# EAGLE schematic AM6548 (EAGLE 9.4.2), part 2 of 4
## Sheet 3 of 19: Regulators and DC-DC converters
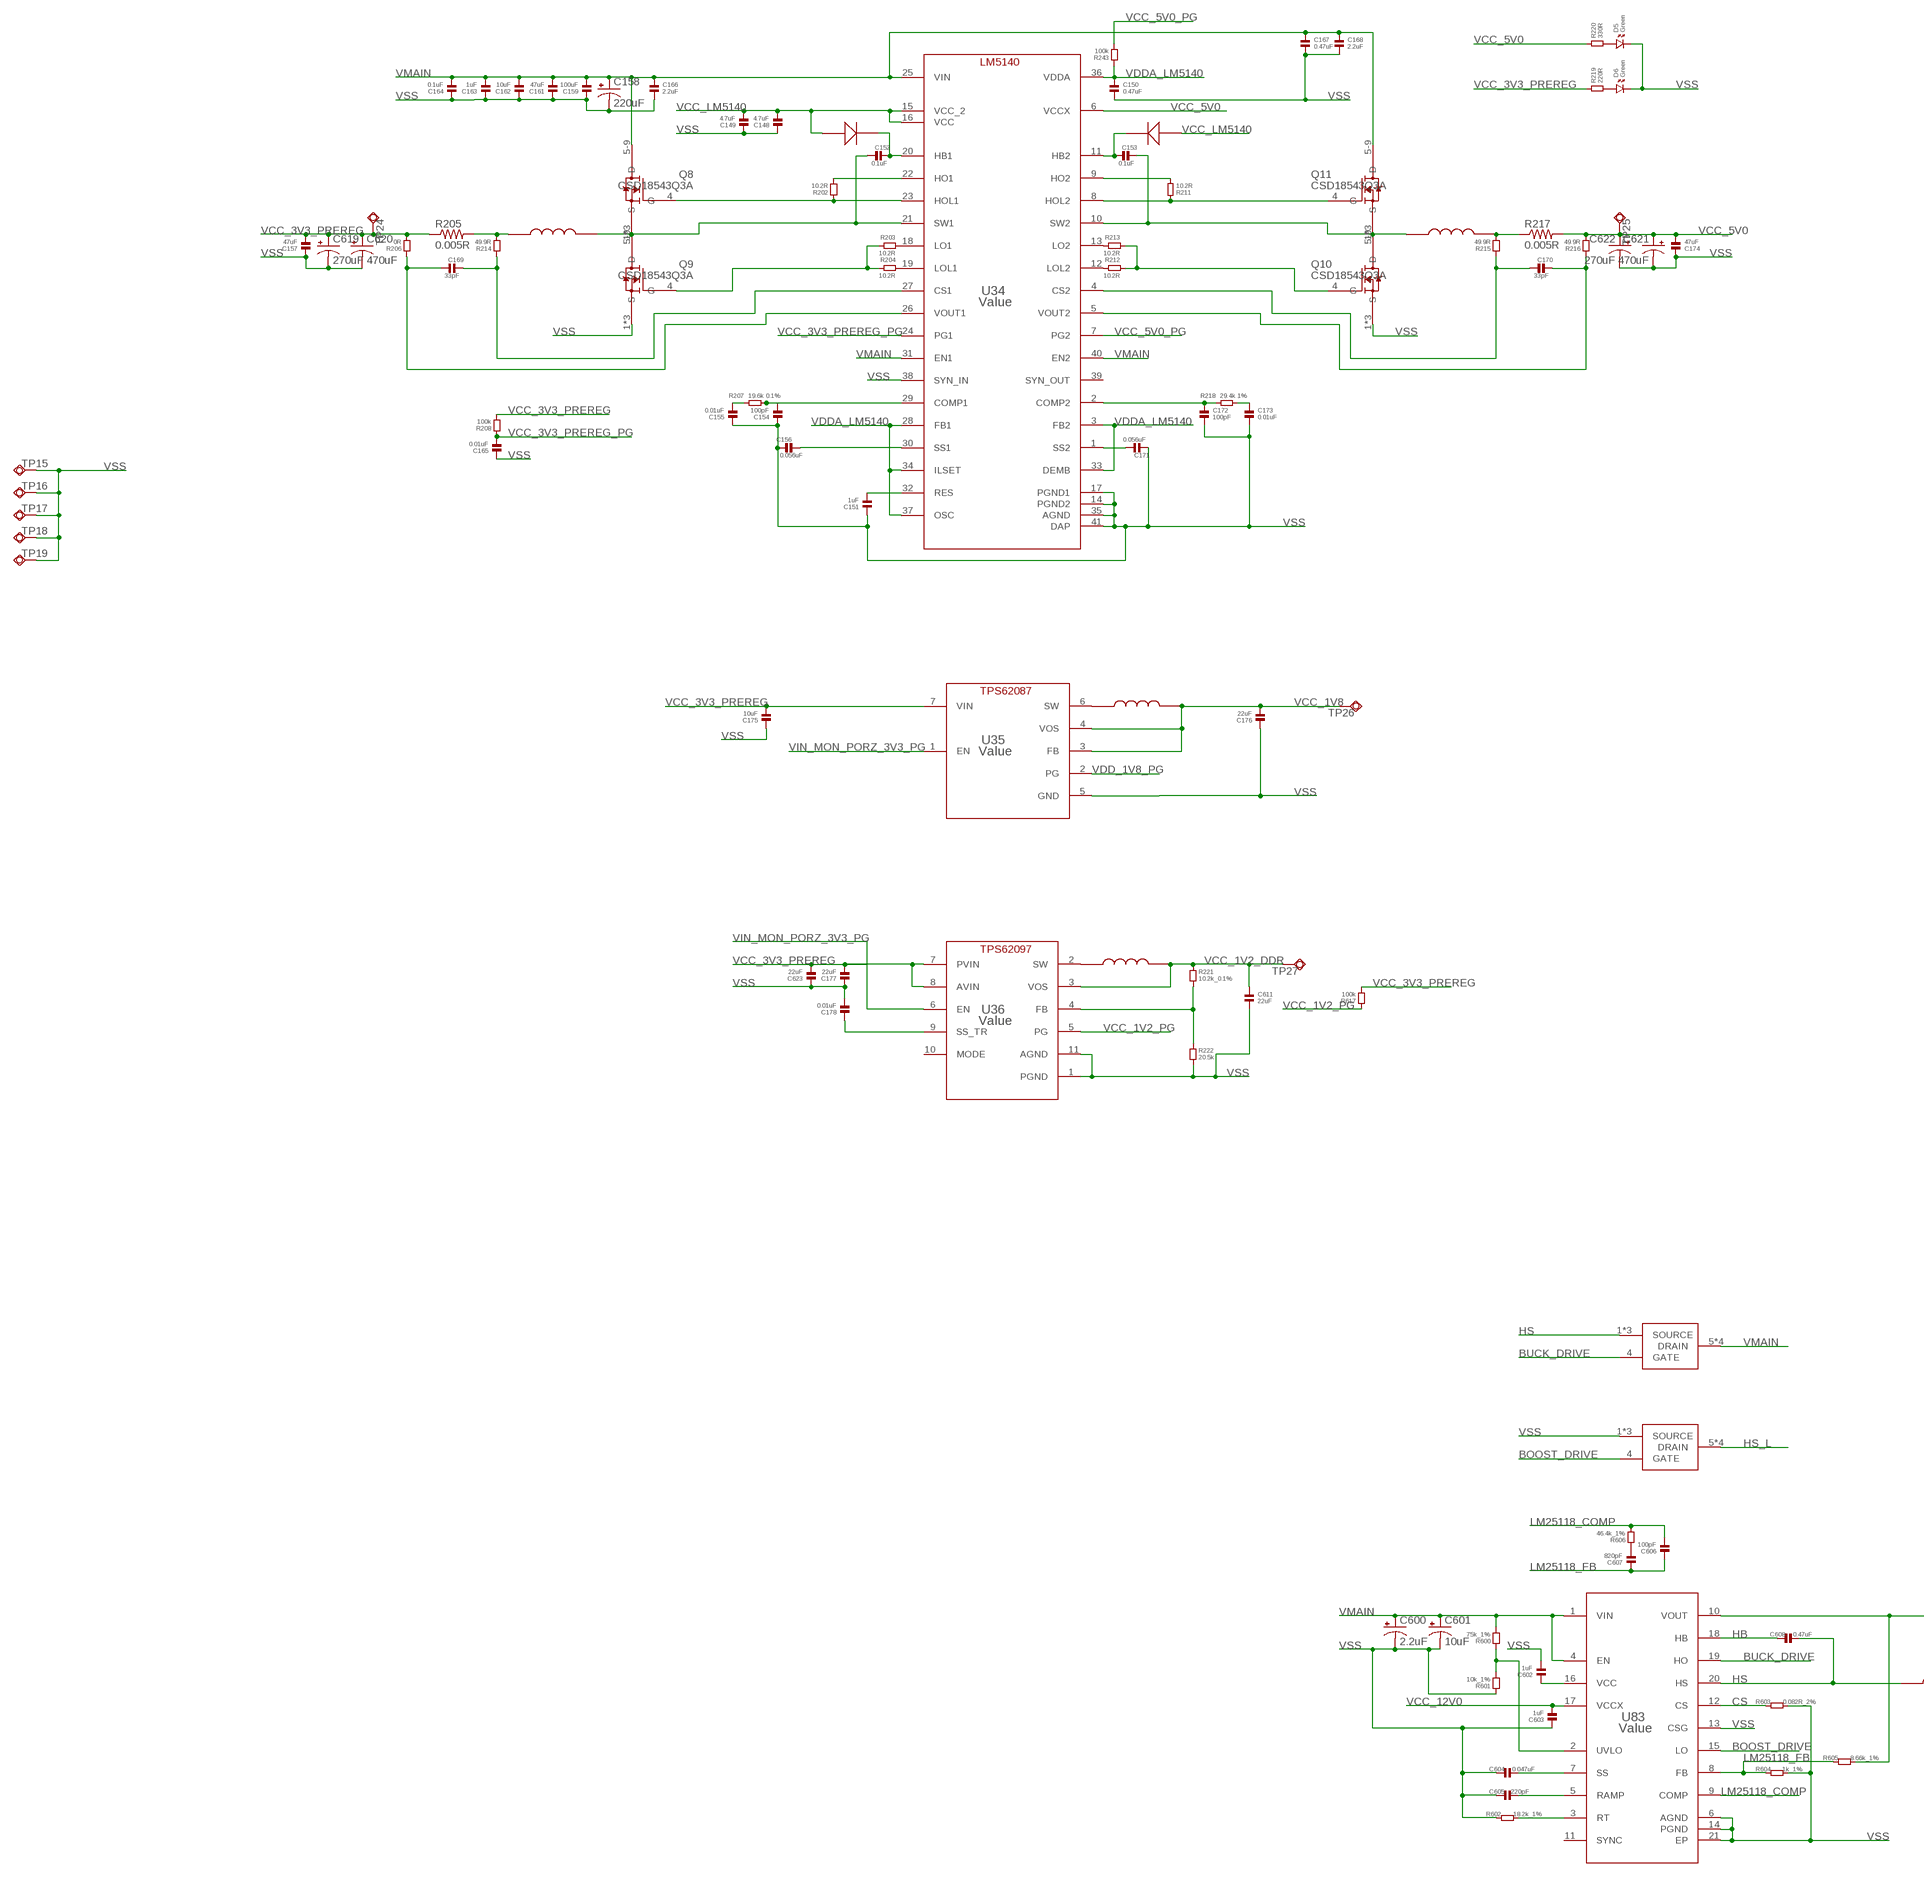
[diagram p4: schematic, sheet 3, part 1 of 3]
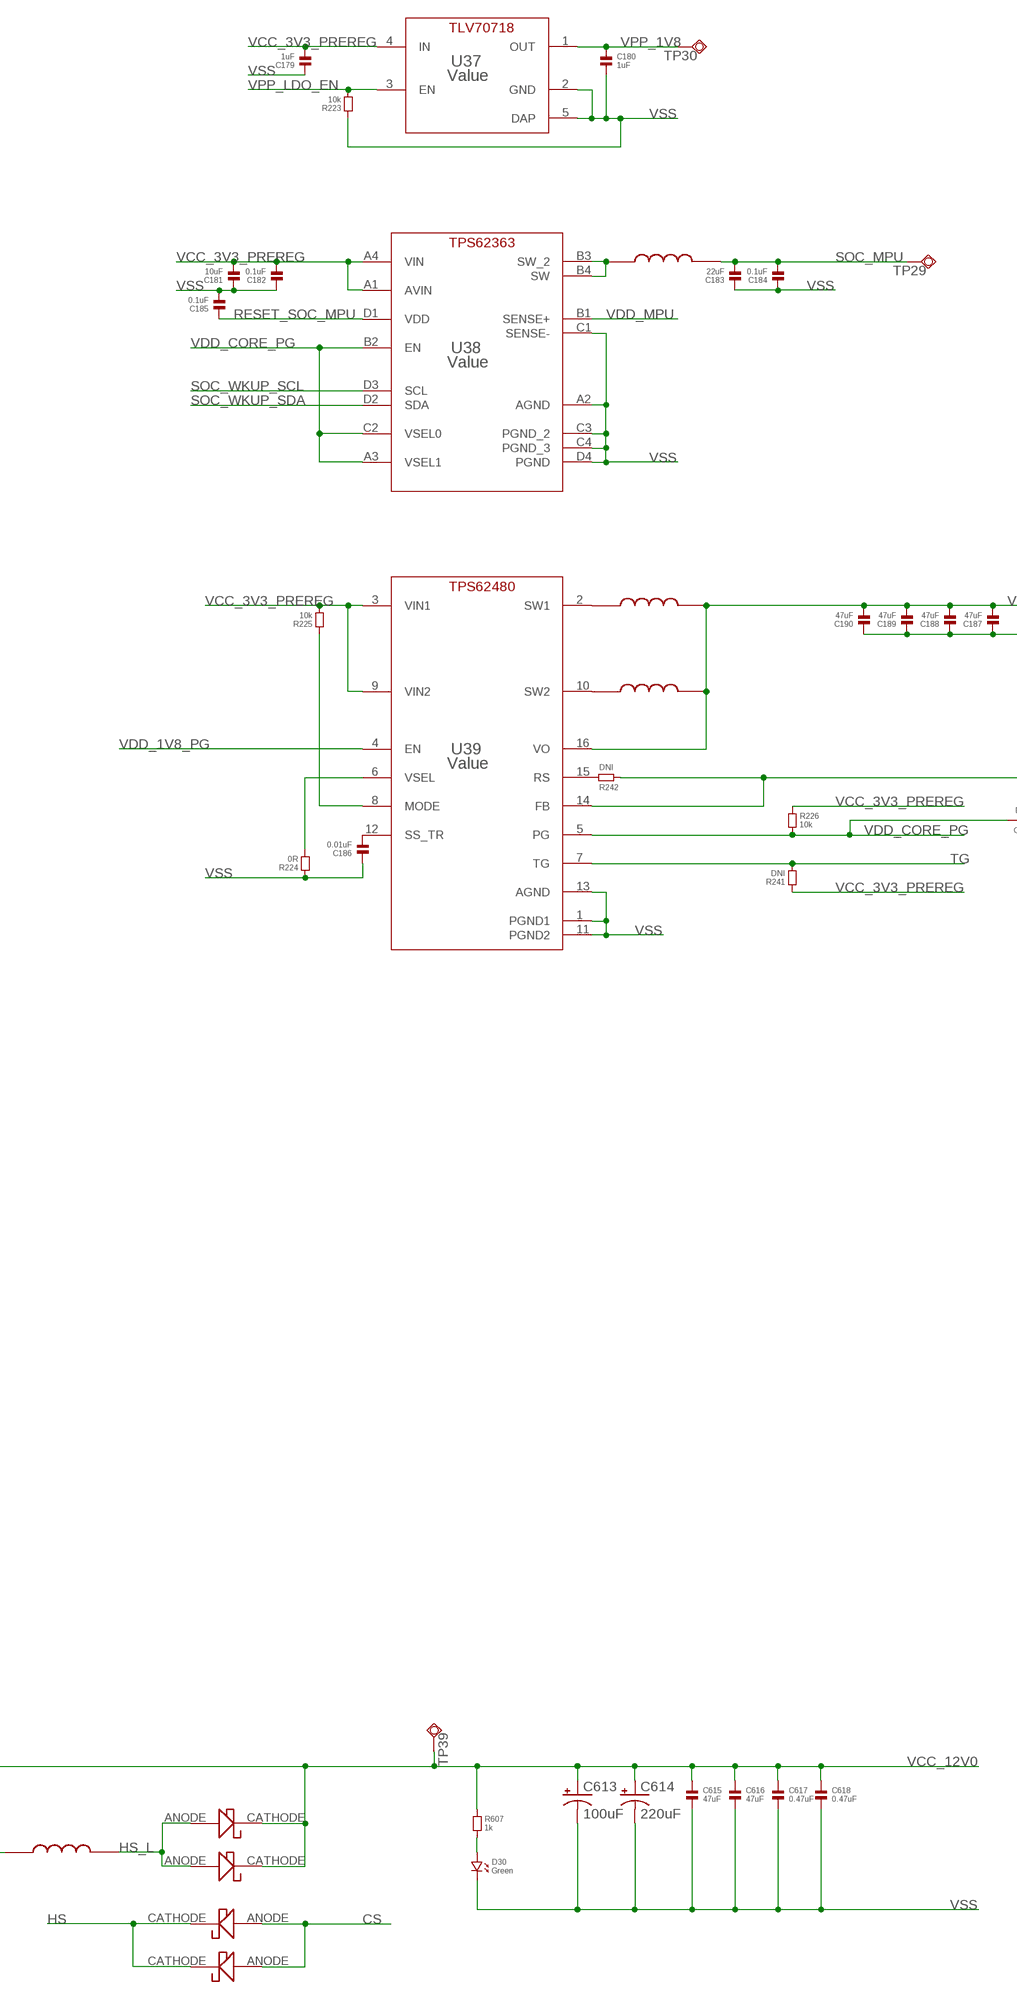
[diagram p5: schematic, sheet 3, part 2 of 3]
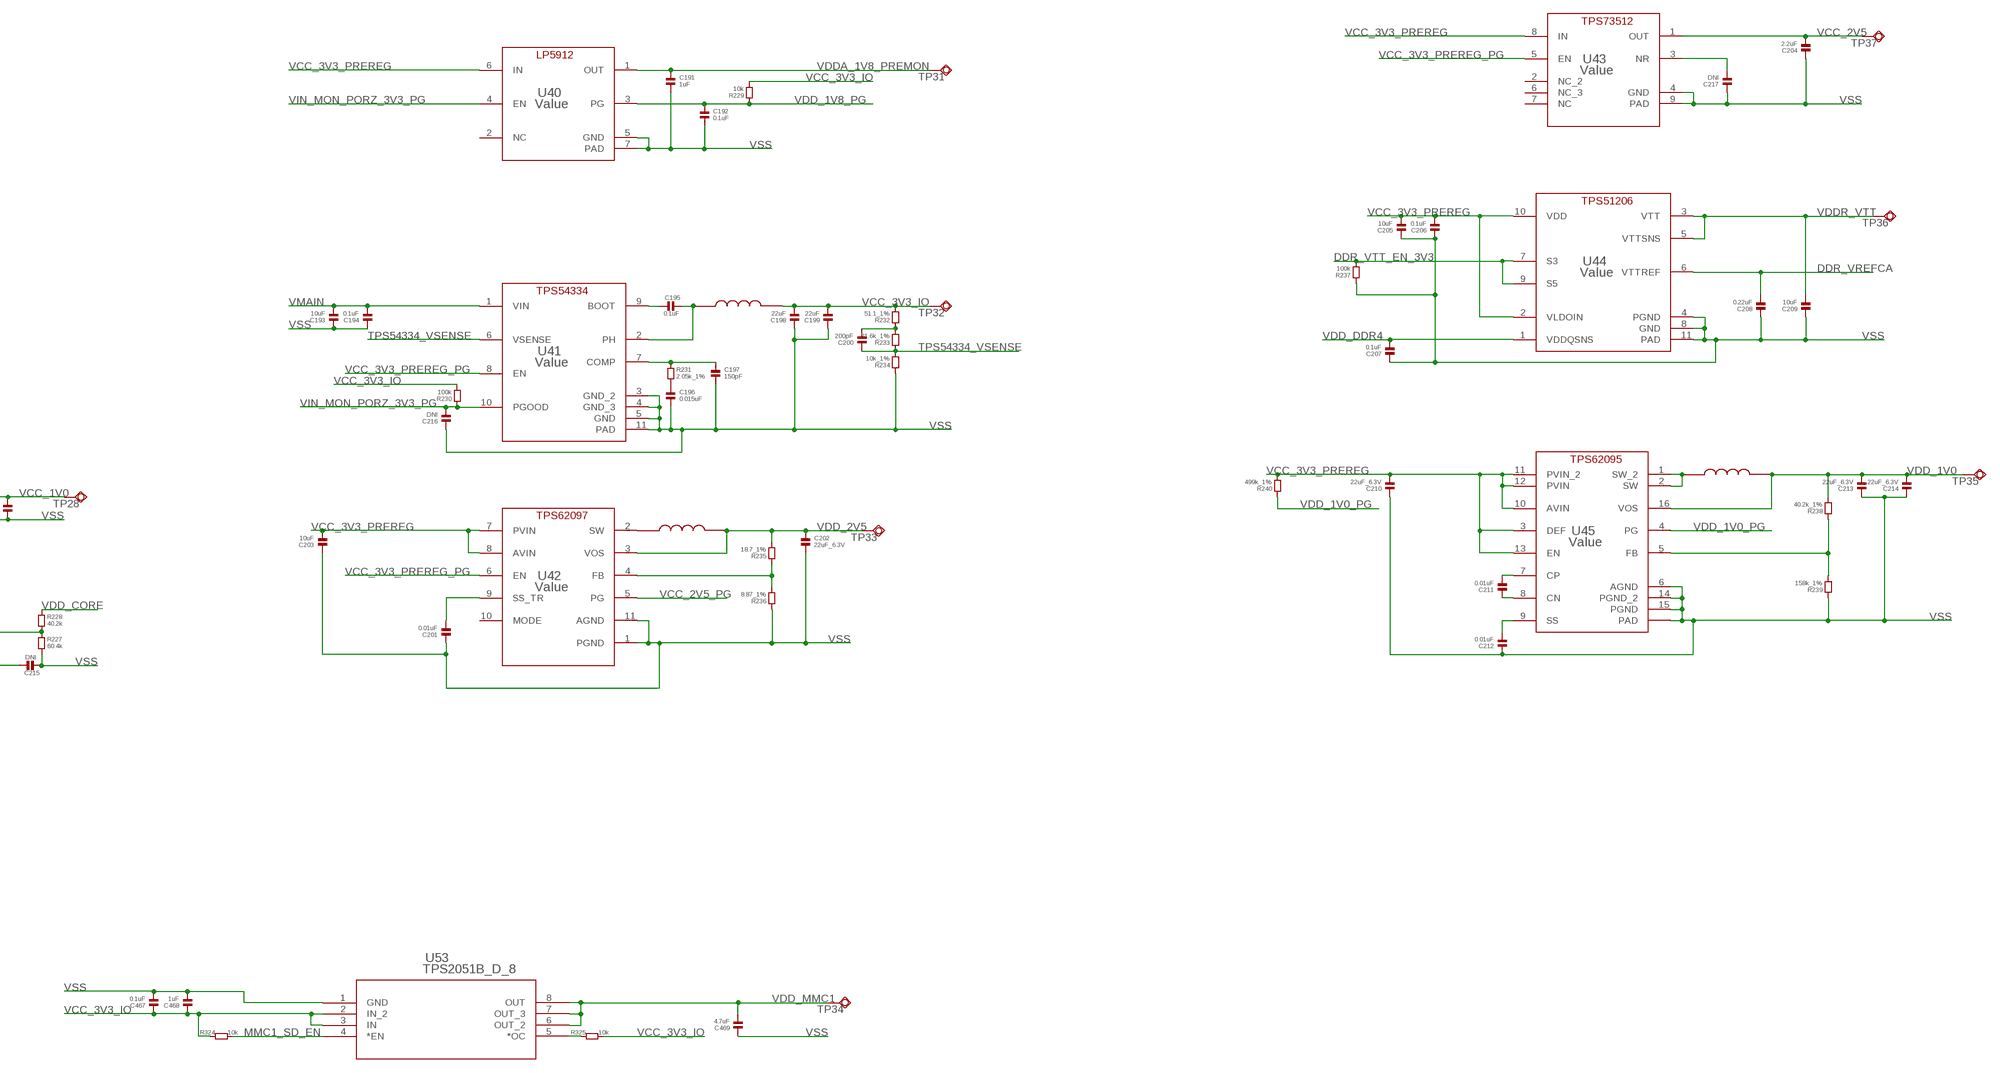
[diagram p6: schematic, sheet 3, part 3 of 3]

### Parts
C148  4.7uF  CAPACITOR.0603  [0603]
C149  4.7uF  CAPACITOR.0603  [0603]
C150  0.47uF  CAPACITOR.0805  [0805]
C151  1uF  CAPACITOR.0603  [0603]
C152  0.1uF  CAPACITOR.0603  [0603]
C153  0.1uF  CAPACITOR.0603  [0603]
C154  100pF  CAPACITOR.0603  [0603]
C155  0.01uF  CAPACITOR.0603  [0603]
C156  0.056uF  CAPACITOR.0603  [0603]
C157  47uF  CAPACITOR.0805  [0805]
C158  220uF  CPOL-USE3.5-8  [E3,5-8]
C159  100uF  CAPACITOR.0805  [0805]
C161  47uF  CAPACITOR.0805  [0805]
C162  10uF  CAPACITOR.0805  [0805]
C163  1uF  CAPACITOR.0805  [0805]
C164  0.1uF  CAPACITOR.0805  [0805]
C165  0.01uF  CAPACITOR.0603  [0603]
C166  2.2uF  CAPACITOR.0603  [0603]
C167  0.47uF  CAPACITOR.0603  [0603]
C168  2.2uF  CAPACITOR.0603  [0603]
C169  33pF  CAPACITOR.0603  [0603]
C170  33pF  CAPACITOR.0603  [0603]
C171  0.056uF  CAPACITOR.0603  [0603]
C172  100pF  CAPACITOR.0603  [0603]
C173  0.01uF  CAPACITOR.0603  [0603]
C174  47uF  CAPACITOR.0805  [0805]
C175  10uF  CAPACITOR.0603  [0603]
C176  22uF  CAPACITOR.0603  [0603]
C177  22uF  CAPACITOR.0603  [0603]
C178  0.01uF  CAPACITOR.0603  [0603]
C179  1uF  CAPACITOR.0603  [0603]
C180  1uF  CAPACITOR.0603  [0603]
C181  10uF  CAPACITOR.0603  [0603]
C182  0.1uF  CAPACITOR.0603  [0603]
C183  22uF  CAPACITOR.0603  [0603]
C184  0.1uF  CAPACITOR.0603  [0603]
C185  0.1uF  CAPACITOR.0603  [0603]
C186  0.01uF  CAPACITOR.0603  [0603]
C187  47uF  CAPACITOR.0805  [0805]
C188  47uF  CAPACITOR.0805  [0805]
C189  47uF  CAPACITOR.0805  [0805]
C190  47uF  CAPACITOR.0805  [0805]
C191  1uF  CAPACITOR.0603  [0603]
C192  0.1uF  CAPACITOR.0603  [0603]
C193  10uF  CAPACITOR.0805  [0805]
C194  0.1uF  CAPACITOR.0805  [0805]
C195  0.1uF  CAPACITOR.0603  [0603]
C196  0.015uF  CAPACITOR.0603  [0603]
C197  150pF  CAPACITOR.0603  [0603]
C198  22uF  CAPACITOR.0603  [0603]
C199  22uF  CAPACITOR.0603  [0603]
C200  200pF  CAPACITOR.0603  [0603]
C201  0.01uF  CAPACITOR.0603  [0603]
C202  22uF_6.3V  CAPACITOR.0603  [0603]
C203  10uF  CAPACITOR.0603  [0603]
C204  2.2uF  CAPACITOR.0603  [0603]
C205  10uF  CAPACITOR.0603  [0603]
C206  0.1uF  CAPACITOR.0603  [0603]
C207  0.1uF  CAPACITOR.0603  [0603]
C208  0.22uF  CAPACITOR.0603  [0603]
C209  10uF  CAPACITOR.0603  [0603]
C210  22uF_6.3V  CAPACITOR.0603  [0603]
C211  0.01uF  CAPACITOR.0603  [0603]
C212  0.01uF  CAPACITOR.0603  [0603]
C213  22uF_6.3V  CAPACITOR.0603  [0603]
C214  22uF_6.3V  CAPACITOR.0603  [0603]
C215  DNI  CAPACITOR.0603  [0603]
C216  DNI  CAPACITOR.0603  [0603]
C217  DNI  CAPACITOR.0603  [0603]
C467  0.1uF  CAPACITOR.0603  [0603]
C468  1uF  CAPACITOR.0603  [0603]
C469  4.7uF  CAPACITOR.0603  [0603]
C600  2.2uF  CPOL-USE2-4  [E2-4]
C601  10uF  CPOL-USE2-5  [E2-5]
C602  1uF  CAPACITOR.0603  [0603]
C603  1uF  CAPACITOR.0603  [0603]
C604  0.047uF  CAPACITOR.0603  [0603]
C605  220pF  CAPACITOR.0603  [0603]
C606  100pF  CAPACITOR.0603  [0603]
C607  820pF  CAPACITOR.0603  [0603]
C608  0.47uF  CAPACITOR.0603  [0603]
C611  22uF  CAPACITOR.0603  [0603]
C613  100uF  CPOL-USE2-5  [E2-5]
C614  220uF  CPOL-USE2-5  [E2-5]
C615  47uF  CAPACITOR.0805  [0805]
C616  47uF  CAPACITOR.0805  [0805]
C617  0.47uF  CAPACITOR.0603  [0603]
C618  0.47uF  CAPACITOR.0603  [0603]
C619  270uF  CPOL-USE3.5-8  [E3,5-8]
C620  470uF  CPOL-USE3.5-8  [E3,5-8]
C621  470uF  CPOL-USE3.5-8  [E3,5-8]
C622  270uF  CPOL-USE3.5-8  [E3,5-8]
C623  22uF  CAPACITOR.0603  [0603]
D5  Green  LED.0603  [0603.LED]
D6  Green  LED.0603  [0603.LED]
D30  Green  LED.0805  [0805.LED]
Q8  CSD18543Q3A  [SON65P300X315X90-9N]
Q9  CSD18543Q3A  [SON65P300X315X90-9N]
Q10  CSD18543Q3A  [SON65P300X315X90-9N]
Q11  CSD18543Q3A  [SON65P300X315X90-9N]
R202  10.2R  RESISTOR.0603  [0603]
R203  10.2R  RESISTOR.0603  [0603]
R204  10.2R  RESISTOR.0603  [0603]
R205  0.005R  R-US_R2512  [R2512]
R206  0R  RESISTOR.0603  [0603]
R207  19.6k 0.1%  RESISTOR.0603  [0603]
R208  100k  RESISTOR.0603  [0603]
R211  10.2R  RESISTOR.0603  [0603]
R212  10.2R  RESISTOR.0603  [0603]
R213  10.2R  RESISTOR.0603  [0603]
R214  49.9R  RESISTOR.0603  [0603]
R215  49.9R  RESISTOR.0603  [0603]
R216  49.9R  RESISTOR.0603  [0603]
R217  0.005R  R-US_R2512  [R2512]
R218  29.4k 1%  RESISTOR.0603  [0603]
R219  220R  RESISTOR.0603  [0603]
R220  330R  RESISTOR.0603  [0603]
R221  10.2k_0.1%  RESISTOR.0603  [0603]
R222  20.5k  RESISTOR.0603  [0603]
R223  10k  RESISTOR.0603  [0603]
R224  0R  RESISTOR.0603  [0603]
R225  10k  RESISTOR.0603  [0603]
R226  10k  RESISTOR.0603  [0603]
R227  60.4k  RESISTOR.0603  [0603]
R228  40.2k  RESISTOR.0603  [0603]
R229  10k  RESISTOR.0603  [0603]
R230  100k  RESISTOR.0603  [0603]
R231  2.05k_1%  RESISTOR.0603  [0603]
R232  51.1_1%  RESISTOR.0603  [0603]
R233  31.6k_1%  RESISTOR.0603  [0603]
R234  10k_1%  RESISTOR.0603  [0603]
R235  18.7_1%  RESISTOR.0603  [0603]
R236  8.87_1%  RESISTOR.0603  [0603]
R237  100k  RESISTOR.0603  [0603]
R238  40.2k_1%  RESISTOR.0603  [0603]
R239  158k_1%  RESISTOR.0603  [0603]
R240  499k_1%  RESISTOR.0603  [0603]
R241  DNI  RESISTOR.0603  [0603]
R242  DNI  RESISTOR.0603  [0603]
R243  100k  RESISTOR.0603  [0603]
R324  10k  RESISTOR.0603  [0603]
R325  10k  RESISTOR.0603  [0603]
R600  75k_1%  RESISTOR.0603  [0603]
R601  10k_1%  RESISTOR.0603  [0603]
R602  18.2k_1%  RESISTOR.0603  [0603]
R603  0.082R_2%  RESISTOR.0603  [0603]
R604  1k_1%  RESISTOR.0603  [0603]
R605  8.66k_1%  RESISTOR.0603  [0603]
R606  46.4k_1%  RESISTOR.0603  [0603]
R607  1k  RESISTOR.0603  [0603]
R617  100k  RESISTOR.0603  [0603]
TP15  TESTPAD_TPSQB1,27  [TESTPAD_B1,27]
TP16  TESTPAD_TPSQB1,27  [TESTPAD_B1,27]
TP17  TESTPAD_TPSQB1,27  [TESTPAD_B1,27]
TP18  TESTPAD_TPSQB1,27  [TESTPAD_B1,27]
TP19  TESTPAD_TPSQB1,27  [TESTPAD_B1,27]
TP24  TESTPAD_TPSQB1,27  [TESTPAD_B1,27]
TP25  TESTPAD_TPSQB1,27  [TESTPAD_B1,27]
TP26  TESTPAD_TPSQB1,27  [TESTPAD_B1,27]
TP27  TESTPAD_TPSQB1,27  [TESTPAD_B1,27]
TP28  TESTPAD_TPSQB1,27  [TESTPAD_B1,27]
TP29  TESTPAD_TPSQB1,27  [TESTPAD_B1,27]
TP30  TESTPAD_TPSQB1,27  [TESTPAD_B1,27]
TP31  TESTPAD_TPSQB1,27  [TESTPAD_B1,27]
TP32  TESTPAD_TPSQB1,27  [TESTPAD_B1,27]
TP33  TESTPAD_TPSQB1,27  [TESTPAD_B1,27]
TP34  TESTPAD_TPSQB1,27  [TESTPAD_B1,27]
TP35  TESTPAD_TPSQB1,27  [TESTPAD_B1,27]
TP36  TESTPAD_TPSQB1,27  [TESTPAD_B1,27]
TP37  TESTPAD_TPSQB1,27  [TESTPAD_B1,27]
TP39  TESTPAD_TPSQB1,27  [TESTPAD_B1,27]
U34  Value  LM5140QRWGRQ1  [RWG0040A]
U35  Value  TPS62087RLTR  [RLT0007A]
U36  Value  TPS62097RWKR  [RWK0011B]
U37  Value  TLV70718DQNR  [DQN0004A]
U38  Value  TPS62363YZHR  [YZH0016AFAF]
U39  Value  TPS62480RNCR  [RNC0016A]
U40  Value  LP5912-1.1DRVR  [DRV0006A]
U41  Value  TPS54334DRCR  [DRC0010J]
U42  Value  TPS62097RWKR  [RWK0011B]
U43  Value  TPS73512DRBR  [DRB0008A]
U44  Value  TPS51206DSQR  [DSQ0010A]
U45  Value  TPS62095RGTR  [RGT0016C]
U53  TPS2051B_D_8  [D8]
U83  Value  LM25118Q1MHX/NOPB  [PWP0020A_N]
U$20  DB2441700L  [DB2441700L]
U$21  DB2441700L  [DB2441700L]
U$22  XEL6030-152MEB  [XEL6030-152MEB]
U$25  XEL6030-152MEB  [XEL6030-152MEB]
U$28  XFL4015-471MEB  [XFL4015-471MEB]
U$29  XFL4020-102MEB  [XFL4020-102MEB]
U$30  XFL4015-471MEB  [XFL4015-471MEB]
U$31  XFL4015-471MEB  [XFL4015-471MEB]
U$32  XFL4015-471MEB  [XFL4015-471MEB]
U$33  XEL4030-682ME_  [XEL4030-682ME_]
U$34  XFL4020-102MEB  [XFL4020-102MEB]
U$35  XFL4020-102MEB  [XFL4020-102MEB]
U$39  XAL40XX  [XAL40XX]
U$40  SSB44-E3/52T  [SMB]
U$41  SSB44-E3/52T  [SMB]
U$42  SI4442DYSO-8  [SOIC127P600X175-8]
U$43  SI4442DYSO-8  [SOIC127P600X175-8]
U$44  SSB44-E3/52T  [SMB]
U$45  SSB44-E3/52T  [SMB]

### Nets
BOOST_DRIVE: U83.15(LO) U$43.4(GATE)
BUCK_DRIVE: U83.19(HO) U$42.4(GATE)
CS: R603.1 U83.12(CS) U$44.ANODE U$45.ANODE
DDR_VREFCA: C208.2 U44.6(VTTREF) ; also sheet 12
DDR_VTT_EN_3V3: R237.2 U44.7(S3) U44.9(S5) ; also sheet 15
HB: C608.1 U83.18(HB)
HS: C608.2 U83.20(HS) U$39.P$1 U$42.1(SOURCE) U$42.2(SOURCE) U$42.3(SOURCE) U$44.CATHODE U$45.CATHODE
HS_L: U$39.P$2 U$40.ANODE U$41.ANODE U$43.5(DRAIN) U$43.6(DRAIN) U$43.7(DRAIN) U$43.8(DRAIN)
LM25118_COMP: C606.2 R606.2 U83.9(COMP)
LM25118_FB: C606.1 C607.1 R604.1 R605.1 U83.8(FB)
MMC1_SD_EN: R324.2 U53.4(*EN)
N$159: C151.2 U34.32(RES)
N$162: C152.1 U34.20(HB1) U$21.CATHODE
N$163: C153.2 U34.11(HB2) U$20.CATHODE
N$164: C152.2 Q8.1(S) Q8.2(S) Q8.3(S) Q9.5-9(D) U34.21(SW1) U$22.P$2
N$165: Q8.4(G) R202.1 U34.23(HOL1)
N$166: R202.2 U34.22(HO1)
N$168: Q9.4(G) R203.1 R204.1
N$169: R203.2 U34.18(LO1)
N$170: R204.2 U34.19(LOL1)
N$171: R205.2 R214.2 U$22.P$1
N$172: C169.1 R214.1 U34.27(CS1)
N$173: C169.2 R206.1 U34.26(VOUT1)
N$174: C154.2 R207.2 U34.29(COMP1)
N$175: C155.2 R207.1
N$176: C156.2 U34.30(SS1)
N$177: C153.1 Q10.5-9(D) Q11.1(S) Q11.2(S) Q11.3(S) U34.10(SW2) U$25.P$1
N$178: Q11.4(G) R211.1 U34.8(HOL2)
N$179: R211.2 U34.9(HO2)
N$180: R212.1 U34.12(LOL2)
N$181: R213.1 U34.13(LO2)
N$182: Q10.4(G) R212.2 R213.2
N$183: R215.2 R217.1 U$25.P$2
N$184: C170.2 R215.1 U34.4(CS2)
N$185: C170.1 R216.1 U34.5(VOUT2)
N$186: C171.2 U34.1(SS2)
N$187: C173.1 R218.2
N$188: C172.1 R218.1 U34.2(COMP2)
N$189: D6.P$1 R219.2
N$190: D5.P$1 R220.2
N$191: U35.6(SW) U$28.P$1
N$192: C178.1 U36.9(SS_TR)
N$193: U36.2(SW) U$29.V
N$195: R221.2 R222.1 U36.4(FB)
N$196: U38.B3(SW_2) U38.B4(SW) U$30.P$1
N$197: C186.2 U39.12(SS_TR)
N$198: R224.2 U39.6(VSEL)
N$199: R225.1 U39.8(MODE)
N$200: U39.2(SW1) U$31.P$1
N$201: U39.10(SW2) U$32.P$1
N$202: R227.1 R228.2 R242.1 U39.14(FB)
N$203: C195.2 U41.2(PH) U$33.P$1
N$204: C195.1 U41.9(BOOT)
N$205: C196.1 R231.2
N$206: C197.1 R231.1 U41.7(COMP)
N$207: C200.2 R232.1 R233.2
N$208: C201.2 U42.9(SS_TR)
N$209: U42.2(SW) U$34.V
N$210: R235.1 R236.2 U42.4(FB)
N$212: C211.2 U45.7(CP)
N$213: C211.1 U45.8(CN)
N$214: C212.2 U45.9(SS)
N$215: U45.1(SW_2) U45.2(SW) U$35.V
N$216: R238.1 R239.2 U45.5(FB)
N$217: R242.2 U39.15(RS)
N$218: C217.2 U43.3(NR)
N$250: R325.1 U53.5(*OC)
N$370: C604.2 U83.7(SS)
N$371: R600.1 R601.2 U83.2(UVLO)
N$372: C605.2 U83.5(RAMP)
N$373: C602.1 U83.16(VCC)
N$374: R602.2 U83.3(RT)
N$375: D30.P$1 R607.2
N$386: C607.2 R606.1
RESET_SOC_MPU: C185.1 U38.D1(VDD) ; also sheet 17
SOC_MPU: C183.2 C184.2 TP29.TP U$30.P$2 ; also sheet 10
SOC_WKUP_SCL: U38.D3(SCL) ; also sheet 1,15,16,17,19
SOC_WKUP_SDA: U38.D2(SDA) ; also sheet 1,15,16,17,19
TG: R241.2 U39.7(TG)
TPS54334_VSENSE: C200.1 R233.1 R234.2 U41.6(VSENSE)
VCC_1V0: C187.2 C188.2 C189.2 C190.2 TP28.TP U39.16(VO) U$31.P$2 U$32.P$2 ; also sheet 10
VCC_1V2_DDR: C611.1 R221.1 TP27.TP U36.3(VOS) U$29.V1 ; also sheet 10
VCC_1V2_PG: R617.1 U36.5(PG)
VCC_1V8: C176.2 TP26.TP U35.3(FB) U35.4(VOS) U$28.P$2 ; also sheet 1,6,7,8,10,13,14,15,18,19
VCC_2V5: C204.2 TP37.TP U43.1(OUT) ; also sheet 12
VCC_2V5_PG: U42.5(PG)
VCC_3V3_IO: C198.2 C199.2 C467.1 C468.1 R229.2 R230.2 R232.2 R324.1 R325.2 TP32.TP U53.2(IN_2) U53.3(IN) U$33.P$2 ; also sheet 1,5,6,7,8,9,10,11,13,14,15,16,17,19
VCC_3V3_PREREG: C157.2 C175.2 C177.2 C179.2 C181.2 C182.2 C203.2 C205.2 C206.2 C210.2 C619.+ C620.+ C623.2 R205.1 R206.2 R208.2 R219.1 R225.2 R226.1 R240.2 R241.1 R617.2 TP24.TP U35.7(VIN) U36.7(PVIN) U36.8(AVIN) U37.4(IN) U38.A1(AVIN) U38.A4(VIN) U39.3(VIN1) U39.9(VIN2) U40.6(IN) U42.7(PVIN) U42.8(AVIN) U43.8(IN) U44.2(VLDOIN) U44.10(VDD) U45.3(DEF) U45.10(AVIN) U45.11(PVIN_2) U45.12(PVIN) U45.13(EN) ; also sheet 1,5
VCC_3V3_PREREG_PG: C165.2 R208.1 U34.24(PG1) U41.8(EN) U42.6(EN) U43.5(EN)
VCC_5V0: C174.2 C621.+ C622.+ R216.2 R217.2 R220.1 TP25.TP U34.6(VCCX) ; also sheet 7,8,9,16,19
VCC_5V0_PG: R243.2 U34.7(PG2)
VCC_12V0: C603.2 C613.+ C614.+ C615.1 C616.1 C617.1 C618.1 R605.2 R607.1 TP39.TP U83.10(VOUT) U83.17(VCCX) U$40.CATHODE U$41.CATHODE ; also sheet 19
VCC_LM5140: C148.2 C149.2 U34.15(VCC_2) U34.16(VCC) U$20.ANODE U$21.ANODE
VDD_1V0: C213.2 C214.2 R238.2 TP35.TP U45.16(VOS) U$35.V1 ; also sheet 6
VDD_1V0_PG: R240.1 U45.4(PG)
VDD_1V8_PG: C192.1 R229.1 U35.2(PG) U39.4(EN) U40.3(PG)
VDD_2V5: C202.1 R235.2 TP33.TP U42.3(VOS) U$34.V1 ; also sheet 6
VDD_CORE: R228.1 ; also sheet 2,10
VDD_CORE_PG: C215.2 R226.2 U38.A3(VSEL1) U38.B2(EN) U38.C2(VSEL0) U39.5(PG)
VDD_DDR4: C207.2 U44.1(VDDQSNS) ; also sheet 10,12
VDD_MMC1: C469.2 TP34.TP U53.6(OUT_2) U53.7(OUT_3) U53.8(OUT) ; also sheet 13
VDD_MPU: U38.B1(SENSE+) ; also sheet 2,5,10
VDDA_1V8_PREMON: C191.1 TP31.TP U40.1(OUT) ; also sheet 10
VDDA_LM5140: C150.1 R243.1 U34.3(FB2) U34.28(FB1) U34.33(DEMB) U34.34(ILSET) U34.36(VDDA) U34.37(OSC)
VDDR_VTT: C209.2 TP36.TP U44.3(VTT) U44.5(VTTSNS) ; also sheet 12
VIN_MON_PORZ_3V3_PG: C216.2 R230.1 U35.1(EN) U36.6(EN) U40.4(EN) U41.10(PGOOD) ; also sheet 5
VMAIN: C158.+ C159.2 C161.2 C162.2 C163.2 C164.2 C166.1 C167.1 C168.1 C193.2 C194.2 C600.+ C601.+ Q8.5-9(D) Q11.5-9(D) R600.2 U34.25(VIN) U34.31(EN1) U34.40(EN2) U41.1(VIN) U83.1(VIN) U83.4(EN) U$42.5(DRAIN) U$42.6(DRAIN) U$42.7(DRAIN) U$42.8(DRAIN) ; also sheet 4,5
VPP_1V8: C180.1 TP30.TP U37.1(OUT) ; also sheet 2
VPP_LDO_EN: R223.2 U37.3(EN)
VSS: C148.1 C149.1 C150.2 C151.1 C154.1 C155.1 C156.1 C157.1 C158.- C159.1 C161.1 C162.1 C163.1 C164.1 C165.1 C166.2 C167.2 C168.2 C171.1 C172.2 C173.2 C174.1 C175.1 C176.1 C177.1 C178.2 C179.1 C180.2 C181.1 C182.1 C183.1 C184.1 C185.2 C186.1 C187.1 C188.1 C189.1 C190.1 C191.2 C192.2 C193.1 C194.1 C196.2 C197.2 C198.1 C199.1 C201.1 C202.2 C203.1 C204.1 C205.1 C206.1 C207.1 C208.1 C209.1 C210.1 C212.1 C213.1 C214.1 C215.1 C216.1 C217.1 C467.2 C468.2 C469.1 C600.- C601.- C602.2 C603.1 C604.1 C605.1 C611.2 C613.- C614.- C615.2 C616.2 C617.2 C618.2 C619.- C620.- C621.- C622.- C623.1 D5.P$2 D6.P$2 D30.P$2 Q9.1(S) Q9.2(S) Q9.3(S) Q10.1(S) Q10.2(S) Q10.3(S) R222.2 R223.1 R224.1 R227.2 R234.1 R236.1 R237.1 R239.1 R601.1 R602.1 R603.2 R604.2 TP15.TP TP16.TP TP17.TP TP18.TP TP19.TP U34.14(PGND2) U34.17(PGND1) U34.35(AGND) U34.38(SYN_IN) U34.41(DAP) U35.5(GND) U36.1(PGND) U36.11(AGND) U37.2(GND) U37.5(DAP) U38.A2(AGND) U38.C1(SENSE-) U38.C3(PGND_2) U38.C4(PGND_3) U38.D4(PGND) U39.1(PGND1) U39.11(PGND2) U39.13(AGND) U40.5(GND) U40.7(PAD) U41.3(GND_2) U41.4(GND_3) U41.5(GND) U41.11(PAD) U42.1(PGND) U42.11(AGND) U43.4(GND) U43.9(PAD) U44.4(PGND) U44.8(GND) U44.11(PAD) U45.6(AGND) U45.14(PGND_2) U45.15(PGND) U45.17(PAD) U53.1(GND) U83.6(AGND) U83.13(CSG) U83.14(PGND) U83.21(EP) U$43.1(SOURCE) U$43.2(SOURCE) U$43.3(SOURCE) ; also sheet 1,2,4,5,6,7,8,9,10,11,12,13,14,15,16,17,18,19
Unconnected: U34.39(SYN_OUT) U36.10(MODE) U40.2(NC) U42.10(MODE) U43.2(NC_2) U43.6(NC_3) U43.7(NC) U83.11(SYNC)

### Notes on the sheet
- LM5140
- TPS73512
- TLV70718
- LP5912
- TPS51206
- TPS62363
- TPS54334
- TPS62095
- TPS62087 | TPS62480
- TPS62097
- TPS62097

## Sheet 4 of 19: Over Voltage Protector
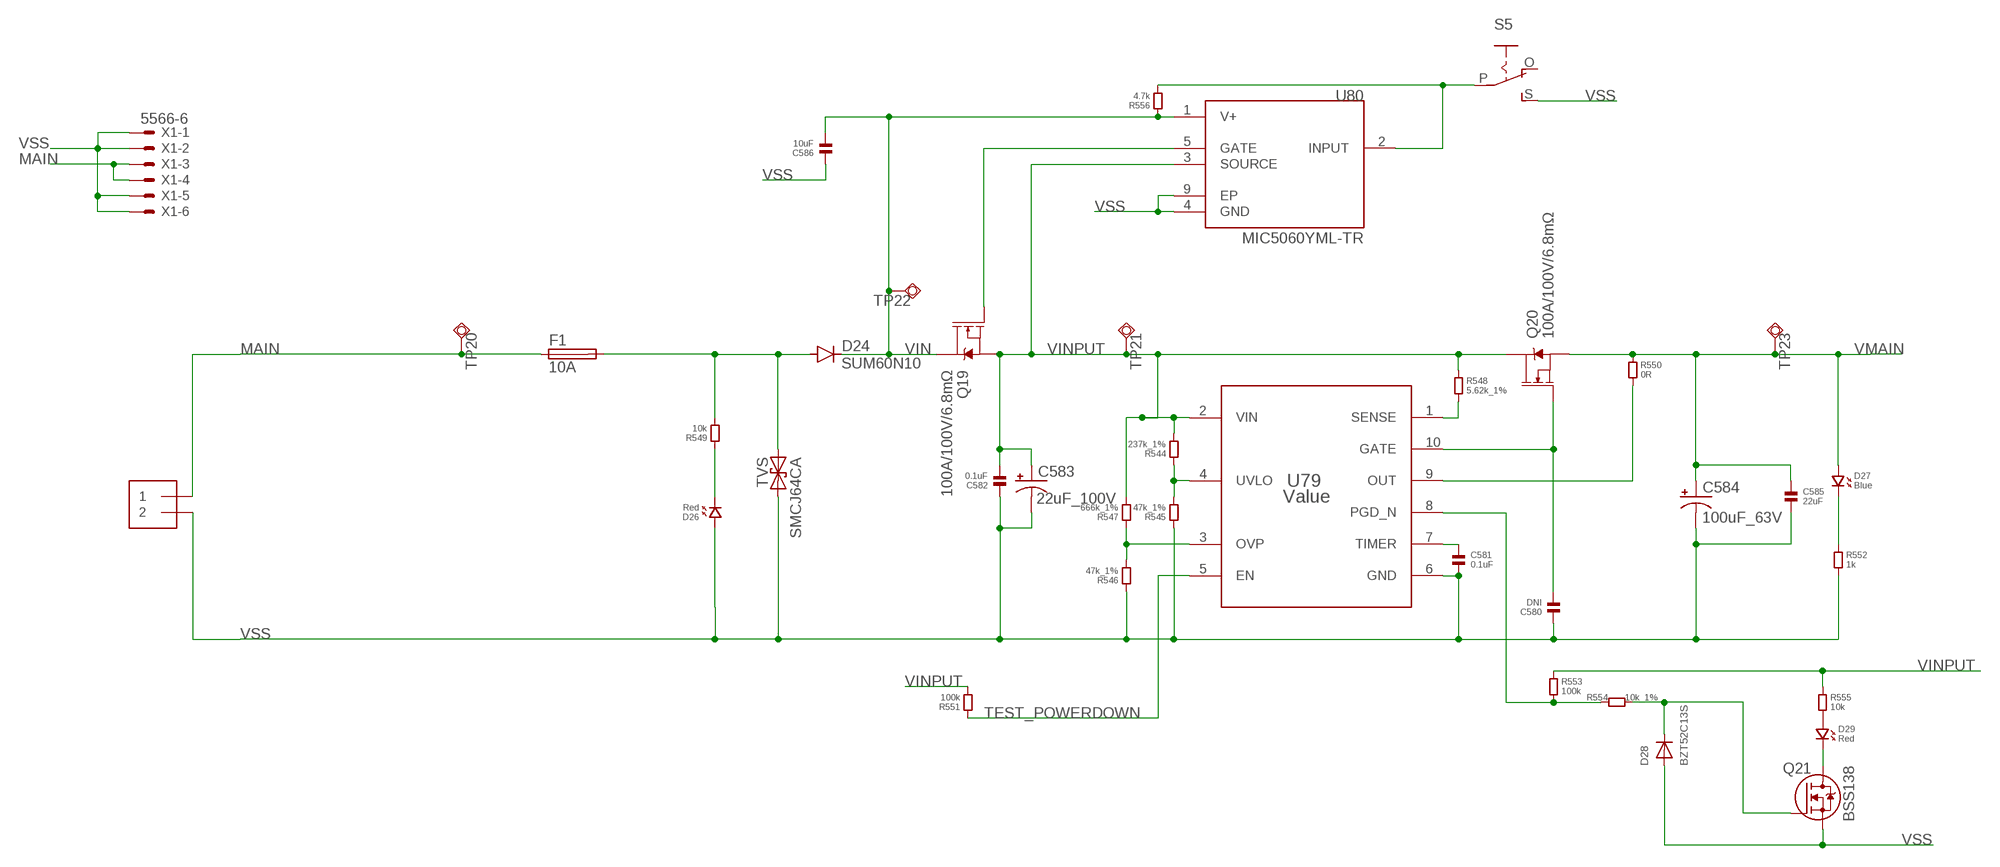
[diagram p7: schematic, sheet 4]

### Parts
C580  DNI  CAPACITOR.0603  [0603]
C581  0.1uF  CAPACITOR.0603  [0603]
C582  0.1uF  CAPACITOR.0805  [0805]
C583  22uF_100V  CPOL-USE2-4  [E2-4]
C584  100uF_63V  CPOL-USE2.5-5  [E2,5-5]
C585  22uF  CAPACITOR.0805  [0805]
C586  10uF  CAPACITOR.0805  [0805]
D24  SUM60N10  DIODE-DO214BA  [DO214BA]
D26  Red  LED.0805  [0805.LED]
D27  Blue  LED.0805  [0805.LED]
D28  BZT52C13S  DIODESOD-323  [SOD-323]
D29  Red  LED.0805  [0805.LED]
F1  10A  TR5  [TR5]
J27  1X2-3.5MM  [1X2-3.5MM]
Q19  100A/100V/6.8mΩ  MOSFET-NCH-PSMN7R0  [TO-263/D2PAK]
Q20  100A/100V/6.8mΩ  MOSFET-NCH-PSMN7R0  [TO-263/D2PAK]
Q21  BSS138  [SOT23]
R544  237k_1%  RESISTOR.0603  [0603]
R545  47k_1%  RESISTOR.0603  [0603]
R546  47k_1%  RESISTOR.0603  [0603]
R547  666k_1%  RESISTOR.0603  [0603]
R548  5.62k_1%  RESISTOR.0603  [0603]
R549  10k  RESISTOR.0805  [0805]
R550  0R  RESISTOR.0603  [0603]
R551  100k  RESISTOR.0603  [0603]
R552  1k  RESISTOR.0805  [0805]
R553  100k  RESISTOR.0603  [0603]
R554  10k_1%  RESISTOR.0603  [0603]
R555  10k  RESISTOR.0805  [0805]
R556  4.7k  RESISTOR.0603  [0603]
S5  EG1218S  [EG1218]
SMCJ64CA  TVS  [SMA-DIODE]
TP20  TESTPAD_TPSQB1,27  [TESTPAD_B1,27]
TP21  TESTPAD_TPSQB1,27  [TESTPAD_B1,27]
TP22  TESTPAD_TPSQB1,27  [TESTPAD_B1,27]
TP23  TESTPAD_TPSQB1,27  [TESTPAD_B1,27]
U79  Value  LM5060Q1MMX/NOPB  [DGS0010A_N]
U80  MIC5060YML-TR  [SON65P300X300X100-9N]
X1  5566-6  [5566-6]

### Nets
MAIN: F1.1 J27.1 TP20.TP X1.3 X1.4
N$380: R544.1 R545.2 U79.4(UVLO)
N$381: R546.2 R547.1 U79.3(OVP)
N$382: R548.2 U79.1(SENSE)
N$383: D24.A F1.2 R549.2 SMCJ64CA.A
N$385: D26.P$2 R549.1
N$387: C580.2 Q20.1(G) U79.10(GATE)
N$388: R550.2 U79.9(OUT)
N$389: D28.C Q21.1(G) R554.1
N$390: C581.1 U79.7(TIMER)
N$391: D27.P$2 R552.1
N$392: D29.P$1 R555.2
N$393: R553.2 R554.2 U79.8(PGD_N)
N$394: D29.P$2 Q21.3(D)
N$395: Q19.1(G) U80.5(GATE)
N$396: R556.2 S5.P U80.2(INPUT)
TEST_POWERDOWN: R551.1 U79.5(EN) ; also sheet 8
VIN: C586.2 D24.C Q19.2(D) R556.1 TP22.TP U80.1(V+)
VINPUT: C582.2 C583.+ Q19.3(S) Q20.2(D) R544.2 R547.2 R548.1 R551.2 R553.1 R555.1 TP21.TP U79.2(VIN) U80.3(SOURCE)
VMAIN: C584.+ C585.1 D27.P$1 Q20.3(S) R550.1 TP23.TP ; also sheet 3,5
VSS: C580.1 C581.2 C582.1 C583.- C584.- C585.2 C586.1 D26.P$1 D28.A J27.2 Q21.2(S) R545.1 R546.1 R552.2 S5.S SMCJ64CA.C U79.6(GND) U80.4(GND) U80.9(EP) X1.1 X1.2 X1.5 X1.6 ; also sheet 1,2,3,5,6,7,8,9,10,11,12,13,14,15,16,17,18,19
Unconnected: S5.O

## Sheet 5 of 19: PORZ
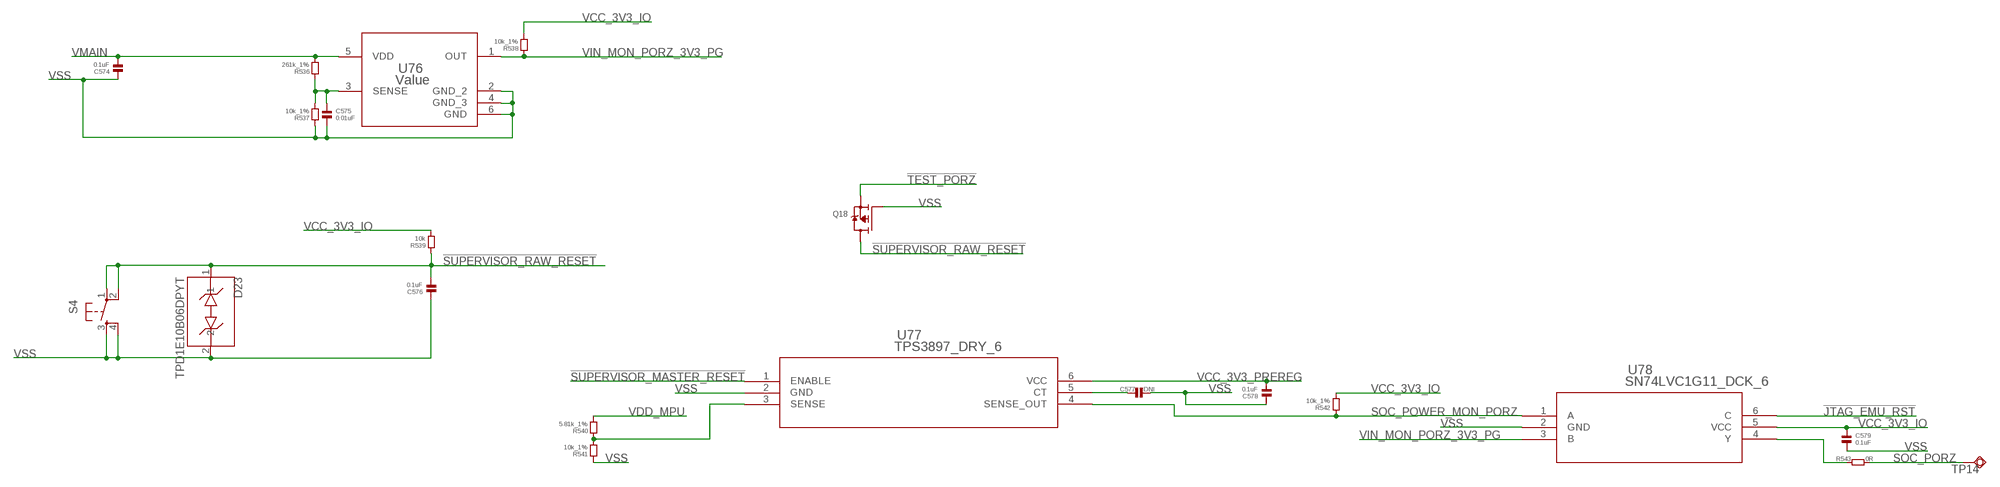
[diagram p8: schematic, sheet 5]

### Parts
C574  0.1uF  CAPACITOR.0402  [0402]
C575  0.01uF  CAPACITOR.0402  [0402]
C576  0.1uF  CAPACITOR.0603  [0603]
C577  DNI  CAPACITOR.0402  [0402]
C578  0.1uF  CAPACITOR.0402  [0402]
C579  0.1uF  CAPACITOR.0402  [0402]
D23  TPD1E10B06DPYT  [DFN100X60X45-2N]
Q18  MOSFET-P  [SOT23-R]
R536  261k_1%  RESISTOR.0402  [0402]
R537  10k_1%  RESISTOR.0402  [0402]
R538  10k_1%  RESISTOR.0402  [0402]
R539  10k  RESISTOR.0603  [0603]
R540  5.81k_1%  RESISTOR.0402  [0402]
R541  10k_1%  RESISTOR.0402  [0402]
R542  10k_1%  RESISTOR.0402  [0402]
R543  0R  RESISTOR.0402  [0402]
S4  TAC_SWITCHPTH  [TACTILE-PTH]
TP14  TESTPAD_TPSQB1,27  [TESTPAD_B1,27]
U76  Value  TPS3711DDCR  [DDC0006A_N]
U77  TPS3897_DRY_6  [DRY6]
U78  SN74LVC1G11_DCK_6  [DCK6]

### Nets
!JTAG_EMU_RST: U78.6(C) ; also sheet 7
!SUPERVISOR_MASTER_RESET: U77.1(ENABLE) ; also sheet 8
!SUPERVISOR_RAW_RESET: C576.2 D23.1 Q18.3(D) R539.1 S4.1 S4.2 ; also sheet 8
!TEST_PORZ: Q18.2(S) ; also sheet 8
N$376: C575.1 R536.1 R537.2 U76.3(SENSE)
N$377: C577.1 U77.5(CT)
N$378: R543.1 U78.4(Y)
N$379: R540.1 R541.2 U77.3(SENSE)
SOC_PORZ: R543.2 TP14.TP ; also sheet 1
SOC_POWER_MON_PORZ: R542.1 U77.4(SENSE_OUT) U78.1(A)
VCC_3V3_IO: C579.1 R538.2 R539.2 R542.2 U78.5(VCC) ; also sheet 1,3,6,7,8,9,10,11,13,14,15,16,17,19
VCC_3V3_PREREG: C578.2 U77.6(VCC) ; also sheet 1,3
VDD_MPU: R540.2 ; also sheet 2,3,10
VIN_MON_PORZ_3V3_PG: R538.1 U76.1(OUT) U78.3(B) ; also sheet 3
VMAIN: C574.2 R536.2 U76.5(VDD) ; also sheet 3,4
VSS: C574.1 C575.2 C576.1 C577.2 C578.1 C579.2 D23.2 Q18.1(G) R537.1 R541.1 S4.3 S4.4 U76.2(GND_2) U76.4(GND_3) U76.6(GND) U77.2(GND) U78.2(GND) ; also sheet 1,2,3,4,6,7,8,9,10,11,12,13,14,15,16,17,18,19

## Sheet 6 of 19: Ethernets
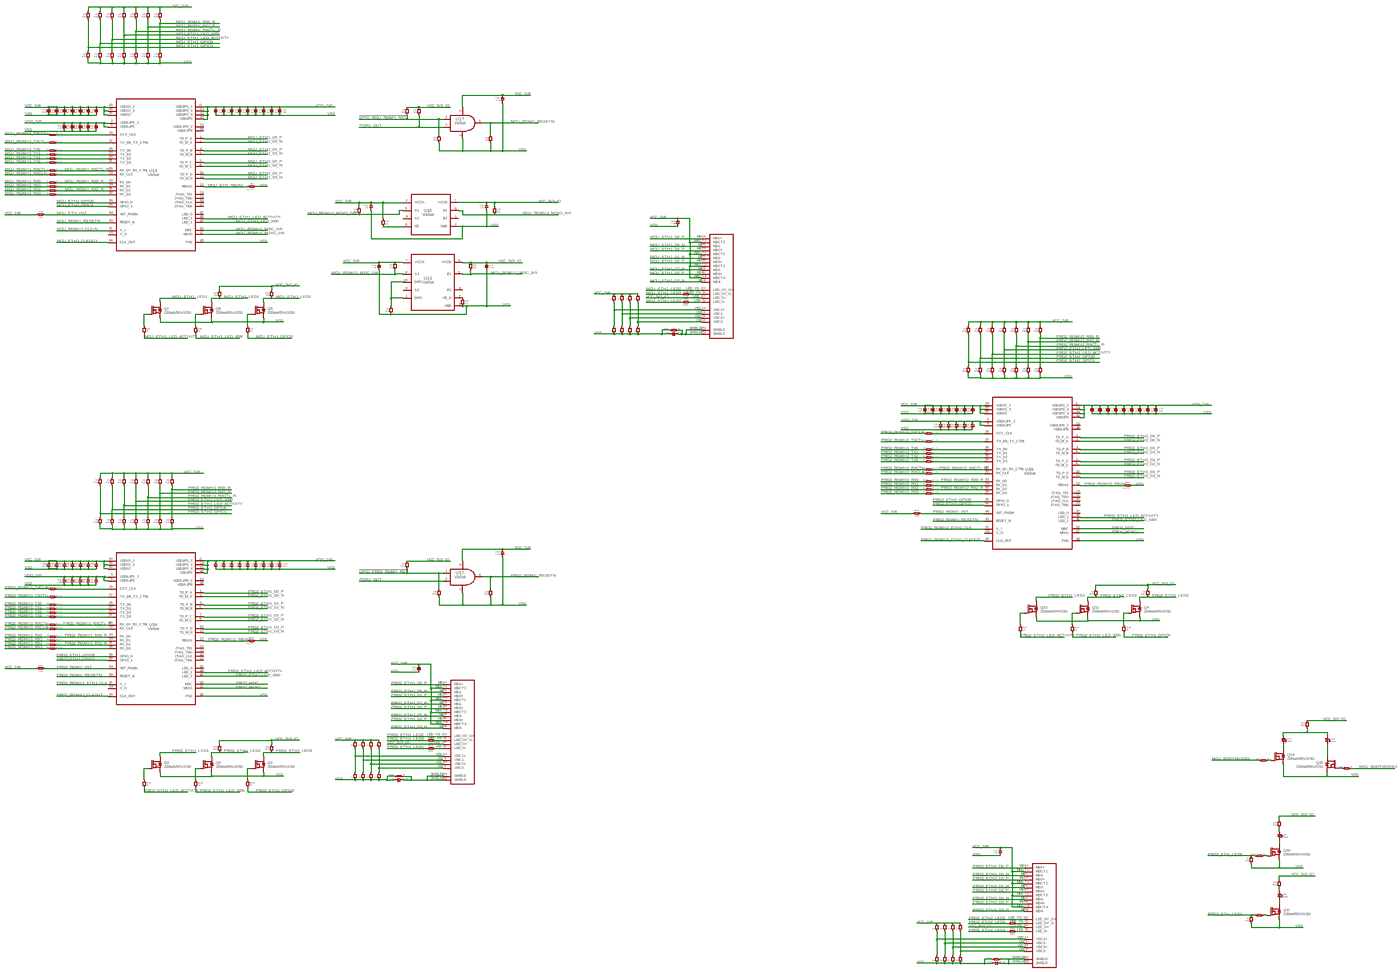
[diagram p9: schematic, sheet 6, overview]
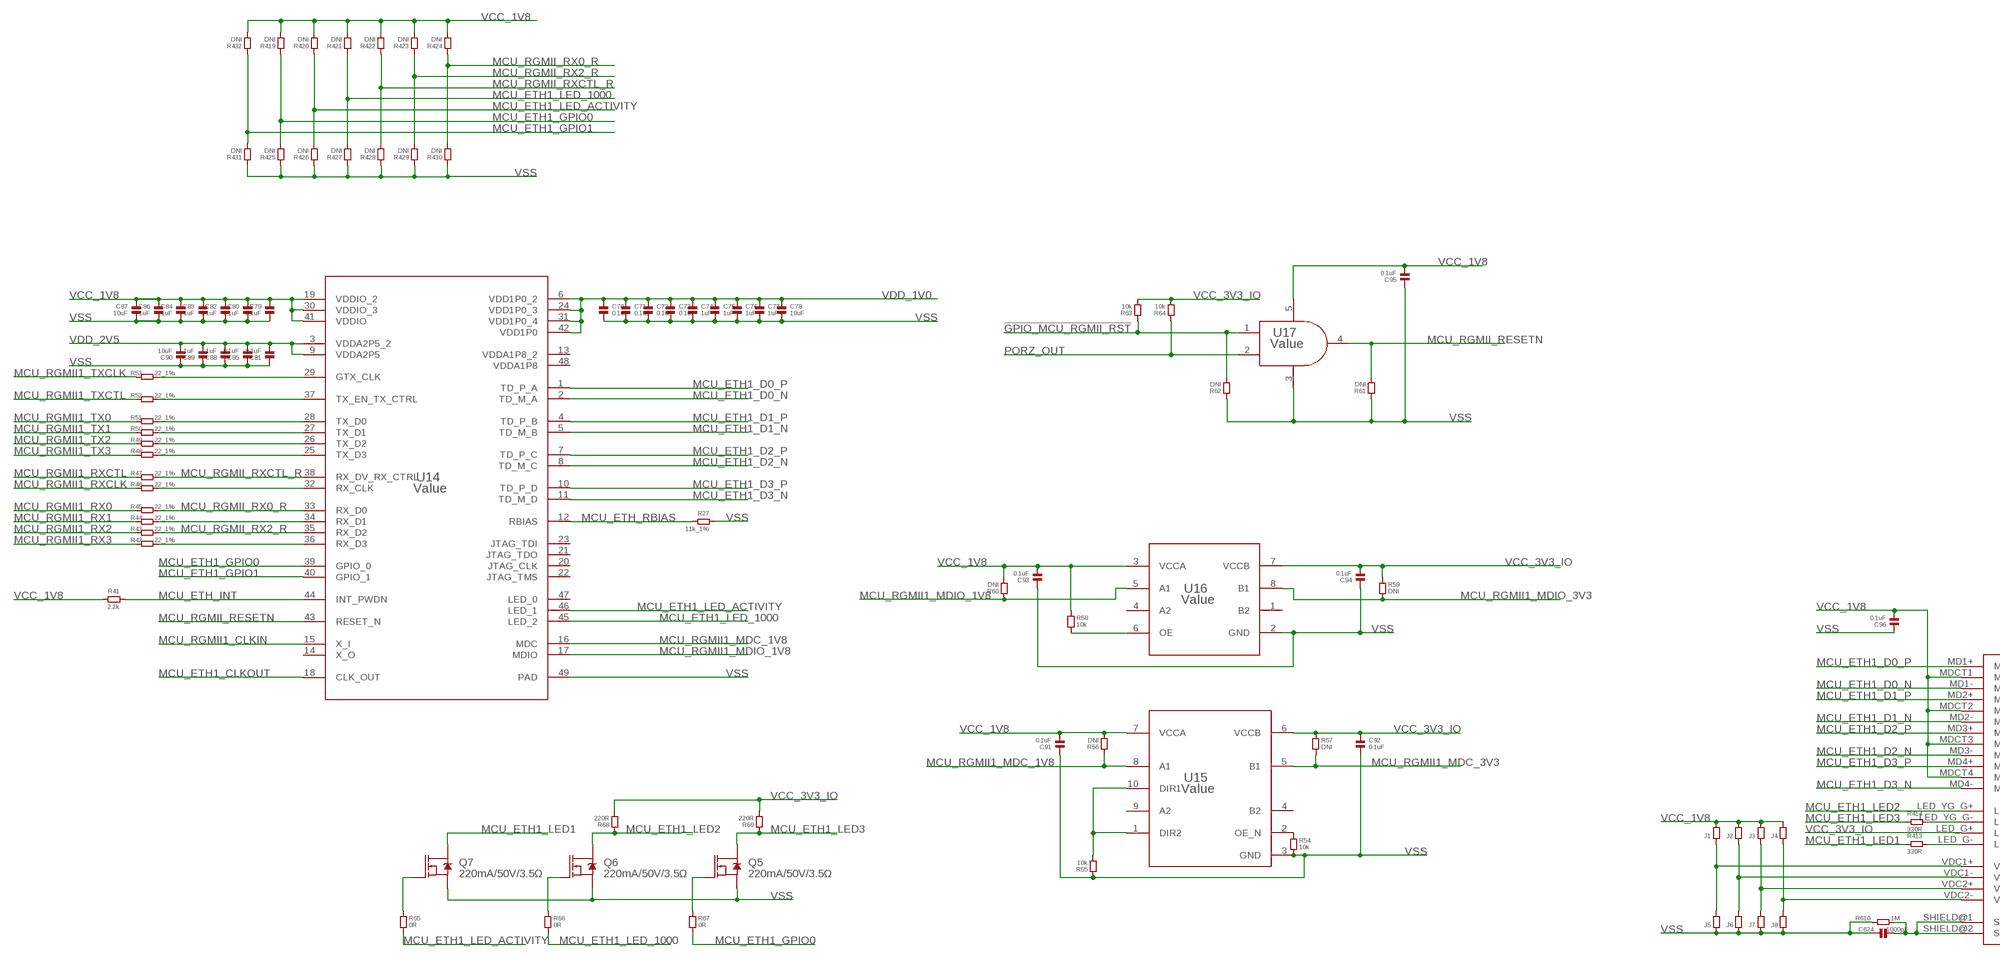
[diagram p10: schematic, sheet 6, part 1 of 4]
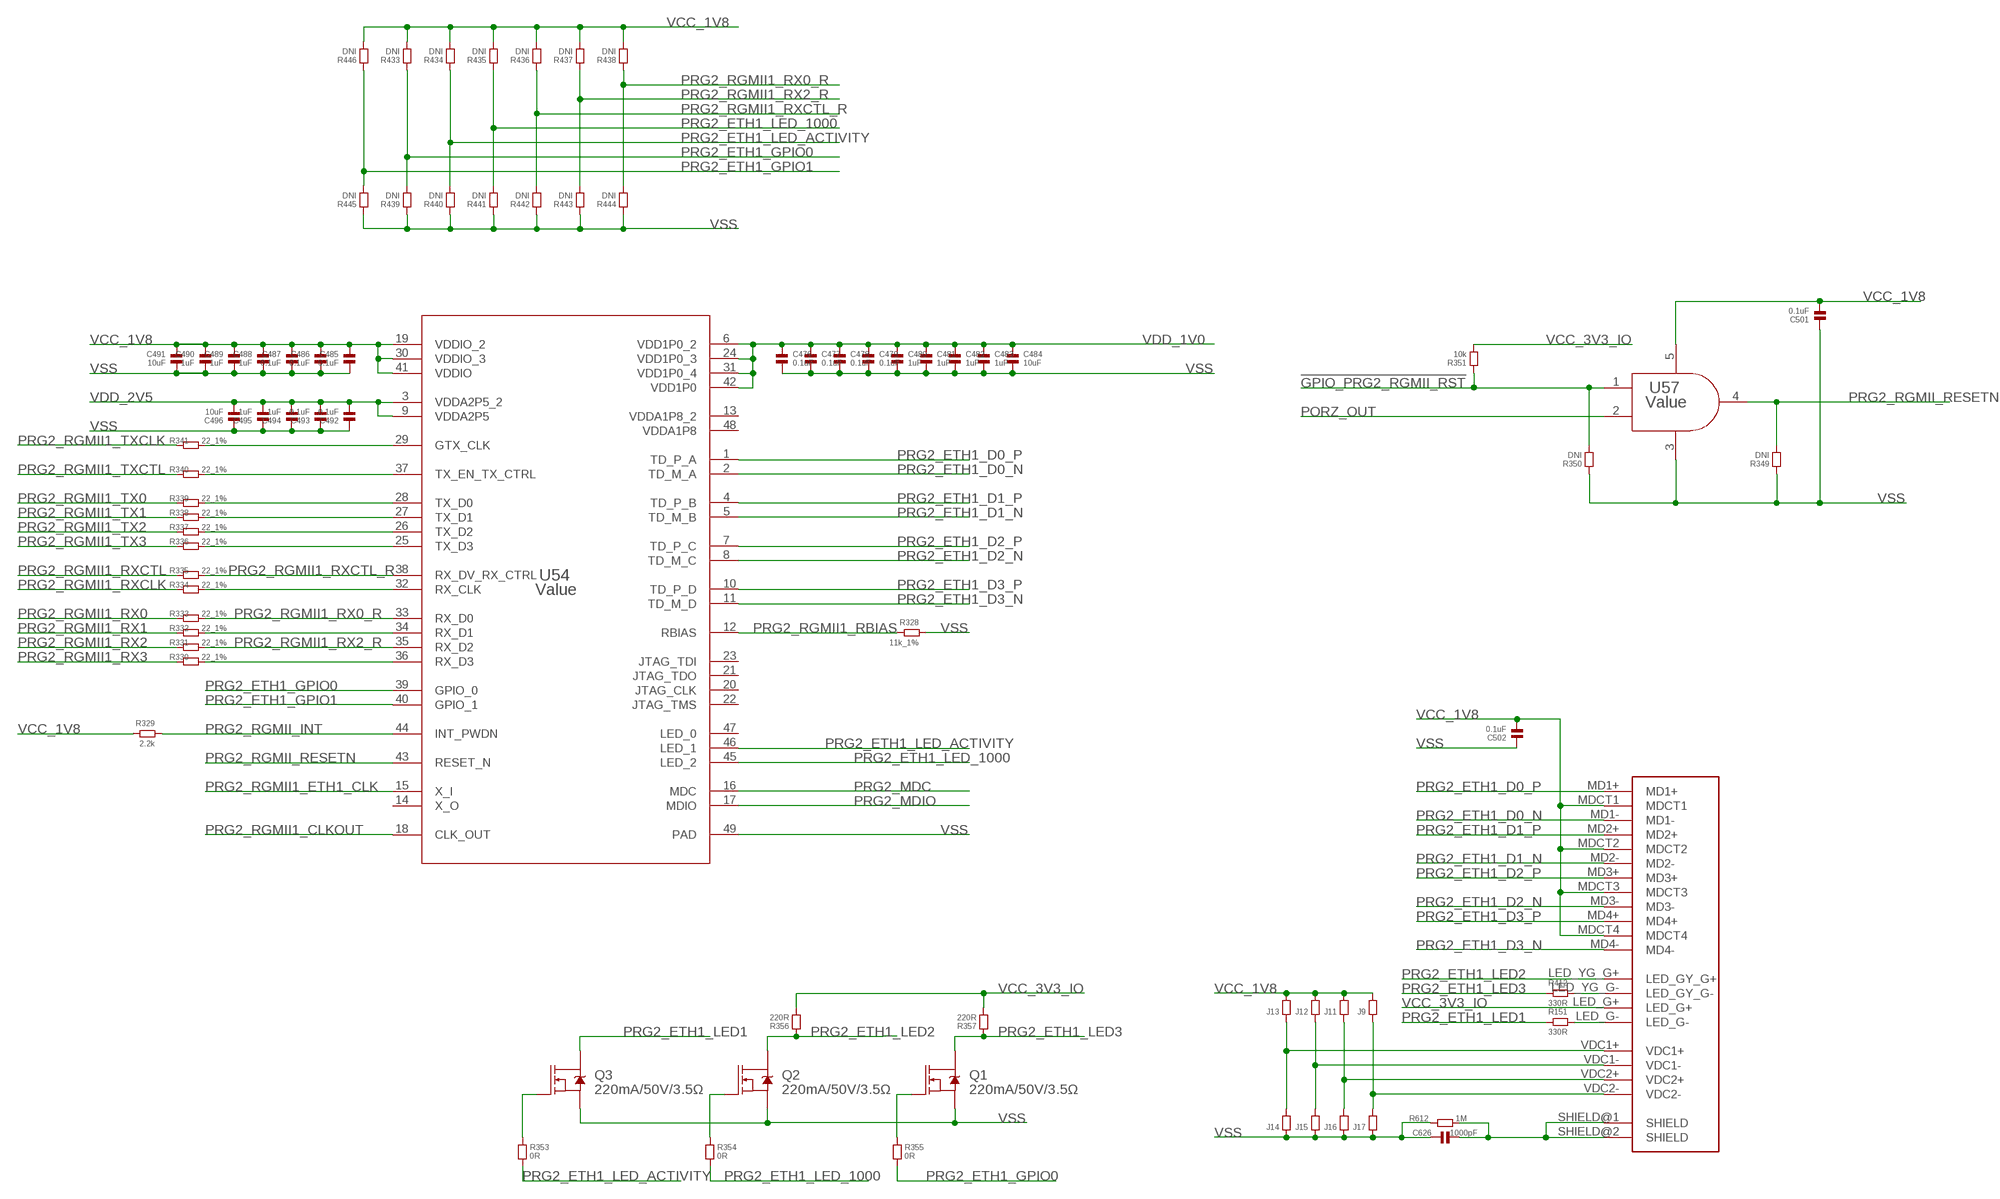
[diagram p11: schematic, sheet 6, part 2 of 4]
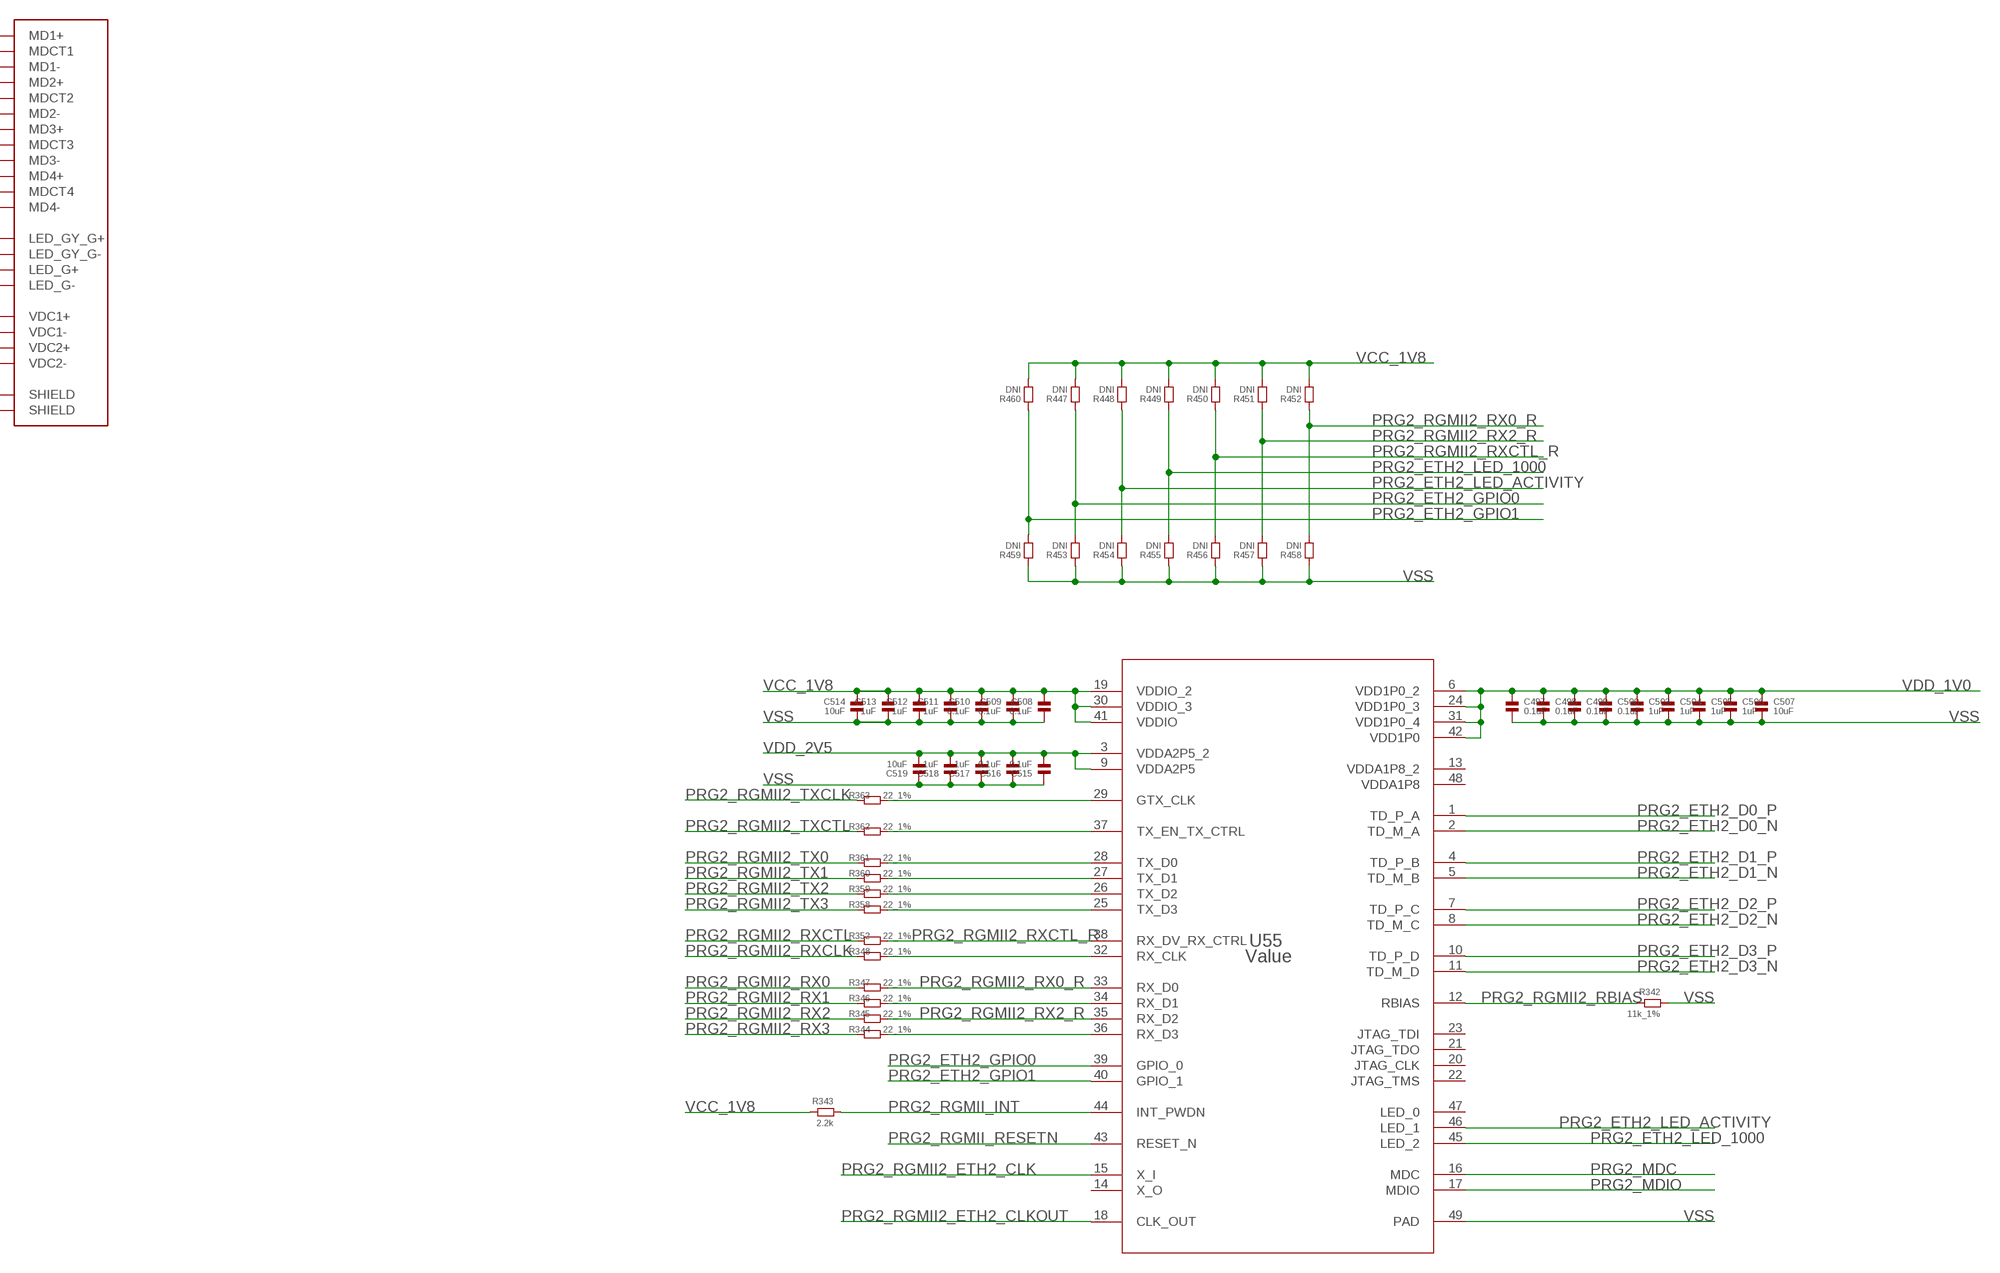
[diagram p12: schematic, sheet 6, part 3 of 4]
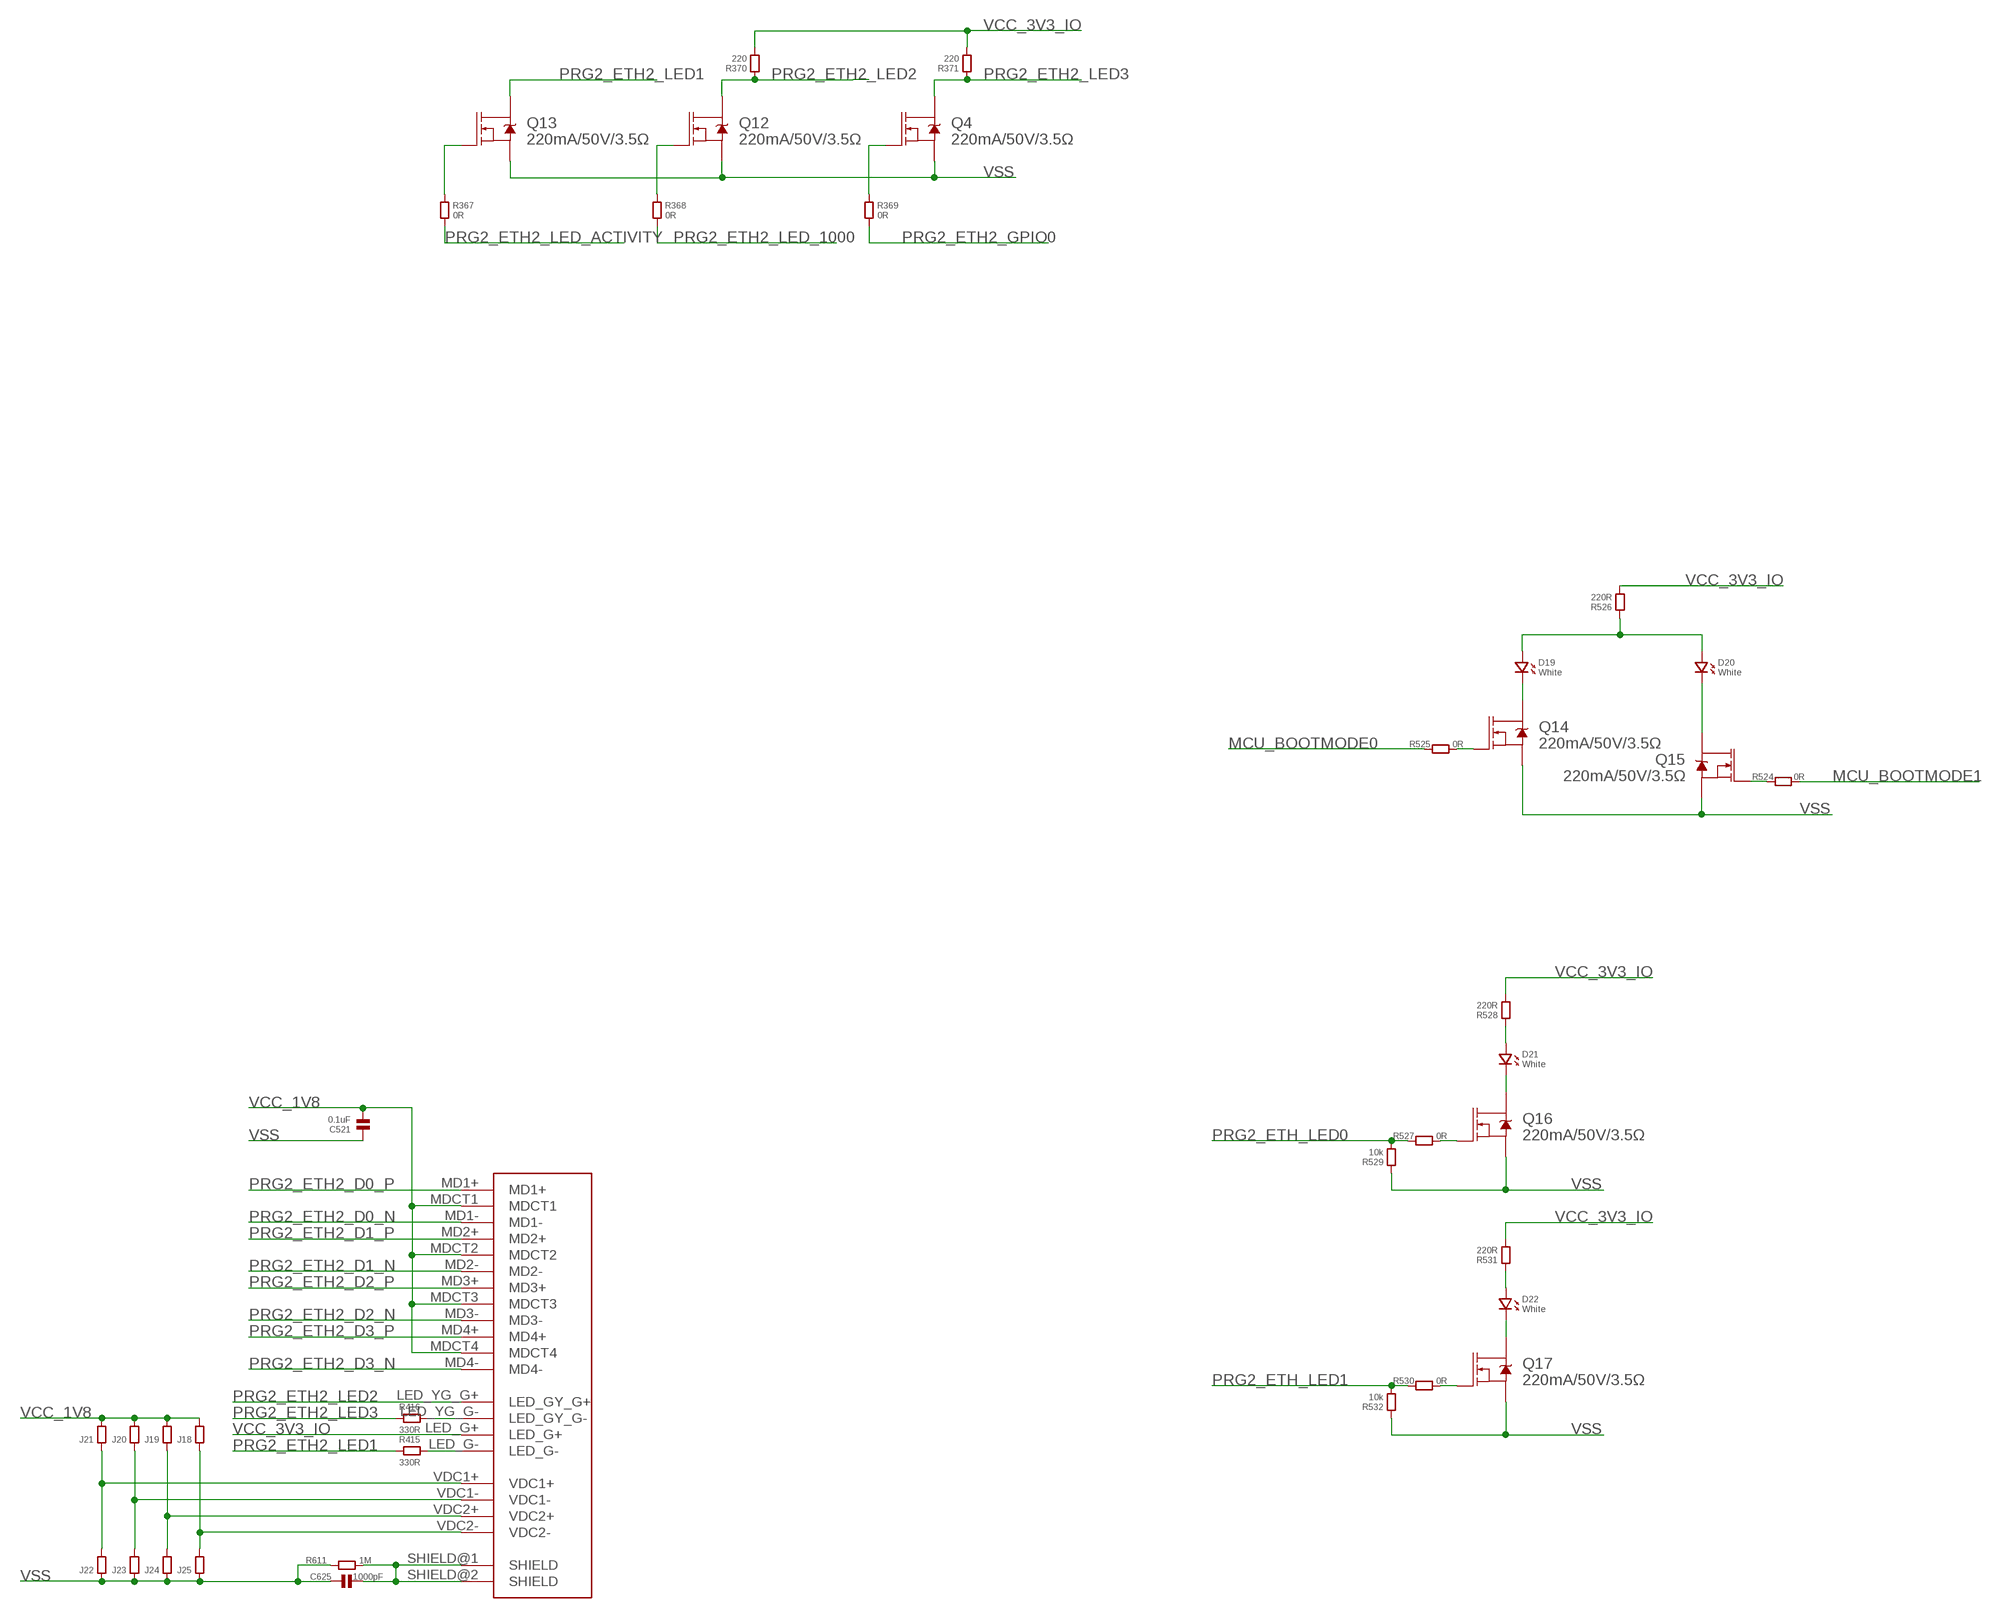
[diagram p13: schematic, sheet 6, part 4 of 4]

### Parts
C70  0.1uF  CAPACITOR.0402  [0402]
C71  0.1uF  CAPACITOR.0402  [0402]
C72  0.1uF  CAPACITOR.0402  [0402]
C73  0.1uF  CAPACITOR.0402  [0402]
C74  1uF  CAPACITOR.0402  [0402]
C75  1uF  CAPACITOR.0402  [0402]
C76  1uF  CAPACITOR.0402  [0402]
C77  1uF  CAPACITOR.0402  [0402]
C78  10uF  CAPACITOR.0603  [0603]
C79  0.1uF  CAPACITOR.0402  [0402]
C80  0.1uF  CAPACITOR.0402  [0402]
C81  0.1uF  CAPACITOR.0402  [0402]
C82  0.1uF  CAPACITOR.0402  [0402]
C83  1uF  CAPACITOR.0402  [0402]
C84  1uF  CAPACITOR.0402  [0402]
C85  0.1uF  CAPACITOR.0402  [0402]
C86  1uF  CAPACITOR.0402  [0402]
C87  10uF  CAPACITOR.0603  [0603]
C88  1uF  CAPACITOR.0402  [0402]
C89  1uF  CAPACITOR.0402  [0402]
C90  10uF  CAPACITOR.0603  [0603]
C91  0.1uF  CAPACITOR.0603  [0603]
C92  0.1uF  CAPACITOR.0603  [0603]
C93  0.1uF  CAPACITOR.0603  [0603]
C94  0.1uF  CAPACITOR.0603  [0603]
C95  0.1uF  CAPACITOR.0603  [0603]
C96  0.1uF  CAPACITOR.0603  [0603]
C476  0.1uF  CAPACITOR.0402  [0402]
C477  0.1uF  CAPACITOR.0402  [0402]
C478  0.1uF  CAPACITOR.0402  [0402]
C479  0.1uF  CAPACITOR.0402  [0402]
C480  1uF  CAPACITOR.0402  [0402]
C481  1uF  CAPACITOR.0402  [0402]
C482  1uF  CAPACITOR.0402  [0402]
C483  1uF  CAPACITOR.0402  [0402]
C484  10uF  CAPACITOR.0603  [0603]
C485  0.1uF  CAPACITOR.0402  [0402]
C486  0.1uF  CAPACITOR.0402  [0402]
C487  0.1uF  CAPACITOR.0402  [0402]
C488  1uF  CAPACITOR.0402  [0402]
C489  1uF  CAPACITOR.0402  [0402]
C490  1uF  CAPACITOR.0402  [0402]
C491  10uF  CAPACITOR.0603  [0603]
C492  0.1uF  CAPACITOR.0402  [0402]
C493  0.1uF  CAPACITOR.0402  [0402]
C494  1uF  CAPACITOR.0402  [0402]
C495  1uF  CAPACITOR.0402  [0402]
C496  10uF  CAPACITOR.0603  [0603]
C497  0.1uF  CAPACITOR.0402  [0402]
C498  0.1uF  CAPACITOR.0402  [0402]
C499  0.1uF  CAPACITOR.0402  [0402]
C500  0.1uF  CAPACITOR.0402  [0402]
C501  0.1uF  CAPACITOR.0603  [0603]
C502  0.1uF  CAPACITOR.0603  [0603]
C503  1uF  CAPACITOR.0402  [0402]
C504  1uF  CAPACITOR.0402  [0402]
C505  1uF  CAPACITOR.0402  [0402]
C506  1uF  CAPACITOR.0402  [0402]
C507  10uF  CAPACITOR.0603  [0603]
C508  0.1uF  CAPACITOR.0402  [0402]
C509  0.1uF  CAPACITOR.0402  [0402]
C510  0.1uF  CAPACITOR.0402  [0402]
C511  1uF  CAPACITOR.0402  [0402]
C512  1uF  CAPACITOR.0402  [0402]
C513  1uF  CAPACITOR.0402  [0402]
C514  10uF  CAPACITOR.0603  [0603]
C515  0.1uF  CAPACITOR.0402  [0402]
C516  0.1uF  CAPACITOR.0402  [0402]
C517  1uF  CAPACITOR.0402  [0402]
C518  1uF  CAPACITOR.0402  [0402]
C519  10uF  CAPACITOR.0603  [0603]
C521  0.1uF  CAPACITOR.0603  [0603]
C624  1000pF  CAPACITOR.0603  [0603]
C625  1000pF  CAPACITOR.0603  [0603]
C626  1000pF  CAPACITOR.0603  [0603]
D19  White  LED.0603  [0603.LED]
D20  White  LED.0603  [0603.LED]
D21  White  LED.0603  [0603.LED]
D22  White  LED.0603  [0603.LED]
J1  RESISTOR.0603  [0603]
J2  RESISTOR.0603  [0603]
J3  RESISTOR.0603  [0603]
J4  RESISTOR.0603  [0603]
J5  RESISTOR.0603  [0603]
J6  RESISTOR.0603  [0603]
J7  RESISTOR.0603  [0603]
J8  RESISTOR.0603  [0603]
J9  RESISTOR.0603  [0603]
J11  RESISTOR.0603  [0603]
J12  RESISTOR.0603  [0603]
J13  RESISTOR.0603  [0603]
J14  RESISTOR.0603  [0603]
J15  RESISTOR.0603  [0603]
J16  RESISTOR.0603  [0603]
J17  RESISTOR.0603  [0603]
J18  RESISTOR.0603  [0603]
J19  RESISTOR.0603  [0603]
J20  RESISTOR.0603  [0603]
J21  RESISTOR.0603  [0603]
J22  RESISTOR.0603  [0603]
J23  RESISTOR.0603  [0603]
J24  RESISTOR.0603  [0603]
J25  RESISTOR.0603  [0603]
Q1  220mA/50V/3.5Ω  MOSFET-NCH-BSS138  [SOT23-3]
Q2  220mA/50V/3.5Ω  MOSFET-NCH-BSS138  [SOT23-3]
Q3  220mA/50V/3.5Ω  MOSFET-NCH-BSS138  [SOT23-3]
Q4  220mA/50V/3.5Ω  MOSFET-NCH-BSS138  [SOT23-3]
Q5  220mA/50V/3.5Ω  MOSFET-NCH-BSS138  [SOT23-3]
Q6  220mA/50V/3.5Ω  MOSFET-NCH-BSS138  [SOT23-3]
Q7  220mA/50V/3.5Ω  MOSFET-NCH-BSS138  [SOT23-3]
Q12  220mA/50V/3.5Ω  MOSFET-NCH-BSS138  [SOT23-3]
Q13  220mA/50V/3.5Ω  MOSFET-NCH-BSS138  [SOT23-3]
Q14  220mA/50V/3.5Ω  MOSFET-NCH-BSS138  [SOT23-3]
Q15  220mA/50V/3.5Ω  MOSFET-NCH-BSS138  [SOT23-3]
Q16  220mA/50V/3.5Ω  MOSFET-NCH-BSS138  [SOT23-3]
Q17  220mA/50V/3.5Ω  MOSFET-NCH-BSS138  [SOT23-3]
R27  11k_1%  RESISTOR.0402  [0402]
R41  2.2k  RESISTOR.0603  [0603]
R42  22_1%  RESISTOR.0402  [0402]
R43  22_1%  RESISTOR.0402  [0402]
R44  22_1%  RESISTOR.0402  [0402]
R45  22_1%  RESISTOR.0402  [0402]
R46  22_1%  RESISTOR.0402  [0402]
R47  22_1%  RESISTOR.0402  [0402]
R48  22_1%  RESISTOR.0402  [0402]
R49  22_1%  RESISTOR.0402  [0402]
R50  22_1%  RESISTOR.0402  [0402]
R51  22_1%  RESISTOR.0402  [0402]
R52  22_1%  RESISTOR.0402  [0402]
R53  22_1%  RESISTOR.0402  [0402]
R54  10k  RESISTOR.0603  [0603]
R55  10k  RESISTOR.0603  [0603]
R56  DNI  RESISTOR.0603  [0603]
R57  DNI  RESISTOR.0603  [0603]
R58  10k  RESISTOR.0603  [0603]
R59  DNI  RESISTOR.0603  [0603]
R60  DNI  RESISTOR.0603  [0603]
R61  DNI  RESISTOR.0603  [0603]
R62  DNI  RESISTOR.0603  [0603]
R63  10k  RESISTOR.0603  [0603]
R64  10k  RESISTOR.0603  [0603]
R65  0R  RESISTOR.0603  [0603]
R66  0R  RESISTOR.0603  [0603]
R67  0R  RESISTOR.0603  [0603]
R68  220R  RESISTOR.0603  [0603]
R69  220R  RESISTOR.0603  [0603]
R151  330R  RESISTOR.0402  [0402]
R328  11k_1%  RESISTOR.0402  [0402]
R329  2.2k  RESISTOR.0402  [0402]
R330  22_1%  RESISTOR.0402  [0402]
R331  22_1%  RESISTOR.0402  [0402]
R332  22_1%  RESISTOR.0402  [0402]
R333  22_1%  RESISTOR.0402  [0402]
R334  22_1%  RESISTOR.0402  [0402]
R335  22_1%  RESISTOR.0402  [0402]
R336  22_1%  RESISTOR.0402  [0402]
R337  22_1%  RESISTOR.0402  [0402]
R338  22_1%  RESISTOR.0402  [0402]
R339  22_1%  RESISTOR.0402  [0402]
R340  22_1%  RESISTOR.0402  [0402]
R341  22_1%  RESISTOR.0402  [0402]
R342  11k_1%  RESISTOR.0402  [0402]
R343  2.2k  RESISTOR.0402  [0402]
R344  22_1%  RESISTOR.0402  [0402]
R345  22_1%  RESISTOR.0402  [0402]
R346  22_1%  RESISTOR.0402  [0402]
R347  22_1%  RESISTOR.0402  [0402]
R348  22_1%  RESISTOR.0402  [0402]
R349  DNI  RESISTOR.0603  [0603]
R350  DNI  RESISTOR.0603  [0603]
R351  10k  RESISTOR.0603  [0603]
R352  22_1%  RESISTOR.0402  [0402]
R353  0R  RESISTOR.0603  [0603]
R354  0R  RESISTOR.0603  [0603]
R355  0R  RESISTOR.0603  [0603]
R356  220R  RESISTOR.0603  [0603]
R357  220R  RESISTOR.0603  [0603]
R358  22_1%  RESISTOR.0402  [0402]
R359  22_1%  RESISTOR.0402  [0402]
R360  22_1%  RESISTOR.0402  [0402]
R361  22_1%  RESISTOR.0402  [0402]
R362  22_1%  RESISTOR.0402  [0402]
R363  22_1%  RESISTOR.0402  [0402]
R367  0R  RESISTOR.0603  [0603]
R368  0R  RESISTOR.0603  [0603]
R369  0R  RESISTOR.0603  [0603]
R370  220  RESISTOR.0603  [0603]
R371  220  RESISTOR.0603  [0603]
R412  330R  RESISTOR.0402  [0402]
R413  330R  RESISTOR.0402  [0402]
R414  330R  RESISTOR.0402  [0402]
R415  330R  RESISTOR.0402  [0402]
R416  330R  RESISTOR.0402  [0402]
R419  DNI  RESISTOR.0402  [0402]
R420  DNI  RESISTOR.0402  [0402]
R421  DNI  RESISTOR.0402  [0402]
R422  DNI  RESISTOR.0402  [0402]
R423  DNI  RESISTOR.0402  [0402]
R424  DNI  RESISTOR.0402  [0402]
R425  DNI  RESISTOR.0402  [0402]
R426  DNI  RESISTOR.0402  [0402]
R427  DNI  RESISTOR.0402  [0402]
R428  DNI  RESISTOR.0402  [0402]
R429  DNI  RESISTOR.0402  [0402]
R430  DNI  RESISTOR.0402  [0402]
R431  DNI  RESISTOR.0402  [0402]
R432  DNI  RESISTOR.0402  [0402]
R433  DNI  RESISTOR.0402  [0402]
R434  DNI  RESISTOR.0402  [0402]
R435  DNI  RESISTOR.0402  [0402]
R436  DNI  RESISTOR.0402  [0402]
R437  DNI  RESISTOR.0402  [0402]
R438  DNI  RESISTOR.0402  [0402]
R439  DNI  RESISTOR.0402  [0402]
R440  DNI  RESISTOR.0402  [0402]
R441  DNI  RESISTOR.0402  [0402]
R442  DNI  RESISTOR.0402  [0402]
R443  DNI  RESISTOR.0402  [0402]
R444  DNI  RESISTOR.0402  [0402]
R445  DNI  RESISTOR.0402  [0402]
R446  DNI  RESISTOR.0402  [0402]
R447  DNI  RESISTOR.0402  [0402]
R448  DNI  RESISTOR.0402  [0402]
R449  DNI  RESISTOR.0402  [0402]
R450  DNI  RESISTOR.0402  [0402]
R451  DNI  RESISTOR.0402  [0402]
R452  DNI  RESISTOR.0402  [0402]
R453  DNI  RESISTOR.0402  [0402]
R454  DNI  RESISTOR.0402  [0402]
R455  DNI  RESISTOR.0402  [0402]
R456  DNI  RESISTOR.0402  [0402]
R457  DNI  RESISTOR.0402  [0402]
R458  DNI  RESISTOR.0402  [0402]
R459  DNI  RESISTOR.0402  [0402]
R460  DNI  RESISTOR.0402  [0402]
R524  0R  RESISTOR.0603  [0603]
R525  0R  RESISTOR.0603  [0603]
R526  220R  RESISTOR.0603  [0603]
R527  0R  RESISTOR.0603  [0603]
R528  220R  RESISTOR.0603  [0603]
R529  10k  RESISTOR.0603  [0603]
R530  0R  RESISTOR.0603  [0603]
R531  220R  RESISTOR.0603  [0603]
R532  10k  RESISTOR.0603  [0603]
R610  1M  RESISTOR.0603  [0603]
R611  1M  RESISTOR.0603  [0603]
R612  1M  RESISTOR.0603  [0603]
U14  Value  DP83867IRRGZR  [RGZ0048B]
U15  Value  SN74AVC2T245RSWR  [RSW0010A]
U16  Value  TXS0102DCUR  [DCU0008A_N]
U17  Value  SN74LVC1G08DBVR  [DBV0005A_N]
U54  Value  DP83867IRRGZR  [RGZ0048B]
U55  Value  DP83867IRRGZR  [RGZ0048B]
U57  Value  SN74LVC1G08DBVR  [DBV0005A_N]
U$11  JK0-2500NL  [JK0-2500NL]
U$12  JK0-2500NL  [JK0-2500NL]
U$17  JK0-2500NL  [JK0-2500NL]

### Nets
!GPIO_MCU_RGMII_RST: R62.2 R63.1 U17.1(A) ; also sheet 17
!GPIO_PRG2_RGMII_RST: R350.2 R351.1 U57.1(A) ; also sheet 17
MCU_BOOTMODE0: R525.1 ; also sheet 1,11
MCU_BOOTMODE1: R524.2 ; also sheet 1,11
MCU_ETH1_CLKOUT: U14.18(CLK_OUT)
MCU_ETH1_D0_N [6mil]: U14.2(TD_M_A) U$17.MD1-
MCU_ETH1_D0_P [6mil]: U14.1(TD_P_A) U$17.MD1+
MCU_ETH1_D1_N [6mil]: U14.5(TD_M_B) U$17.MD2-
MCU_ETH1_D1_P [6mil]: U14.4(TD_P_B) U$17.MD2+
MCU_ETH1_D2_N [6mil]: U14.8(TD_M_C) U$17.MD3-
MCU_ETH1_D2_P [6mil]: U14.7(TD_P_C) U$17.MD3+
MCU_ETH1_D3_N [6mil]: U14.11(TD_M_D) U$17.MD4-
MCU_ETH1_D3_P [6mil]: U14.10(TD_P_D) U$17.MD4+
MCU_ETH1_GPIO0: R67.2 R419.1 R425.2 U14.39(GPIO_0)
MCU_ETH1_GPIO1: R431.2 R432.1 U14.40(GPIO_1)
MCU_ETH1_LED1: Q7.3(D) R413.1
MCU_ETH1_LED2: Q6.3(D) R68.1 U$17.LED_YG_G+(LED_GY_G+)
MCU_ETH1_LED3: Q5.3(D) R69.1 R414.1
MCU_ETH1_LED_1000: R66.2 R421.1 R427.2 U14.45(LED_2)
MCU_ETH1_LED_ACTIVITY: R65.2 R420.1 R426.2 U14.46(LED_1)
MCU_ETH_INT: R41.1 U14.44(INT_PWDN)
MCU_ETH_RBIAS: R27.2 U14.12(RBIAS)
MCU_RGMII1_CLKIN: U14.15(X_I) ; also sheet 14
MCU_RGMII1_MDC_1V8: R56.1 U14.16(MDC) U15.8(A1)
MCU_RGMII1_MDC_3V3: R57.2 U15.5(B1) ; also sheet 1
MCU_RGMII1_MDIO_1V8: R60.1 U14.17(MDIO) U16.5(A1)
MCU_RGMII1_MDIO_3V3: R59.2 U16.8(B1) ; also sheet 1
MCU_RGMII1_RX0: R45.1 ; also sheet 1
MCU_RGMII1_RX1: R44.1 ; also sheet 1
MCU_RGMII1_RX2: R43.1 ; also sheet 1
MCU_RGMII1_RX3: R42.1 ; also sheet 1
MCU_RGMII1_RXCLK: R46.1 ; also sheet 1
MCU_RGMII1_RXCTL: R47.1 ; also sheet 1
MCU_RGMII1_TX0: R51.1 ; also sheet 1
MCU_RGMII1_TX1: R50.1 ; also sheet 1
MCU_RGMII1_TX2: R49.1 ; also sheet 1
MCU_RGMII1_TX3: R48.1 ; also sheet 1
MCU_RGMII1_TXCLK: R53.1 ; also sheet 1
MCU_RGMII1_TXCTL: R52.1 ; also sheet 1
MCU_RGMII_RESETN: R61.2 U14.43(RESET_N) U17.4(Y)
MCU_RGMII_RX0_R: R45.2 R424.1 R430.2 U14.33(RX_D0)
MCU_RGMII_RX2_R: R43.2 R423.1 R429.2 U14.35(RX_D2)
MCU_RGMII_RXCTL_R: R47.2 R422.1 R428.2 U14.38(RX_DV_RX_CTRL)
N$48: R341.2 U54.29(GTX_CLK)
N$49: R340.2 U54.37(TX_EN_TX_CTRL)
N$50: R53.2 U14.29(GTX_CLK)
N$51: R52.2 U14.37(TX_EN_TX_CTRL)
N$52: R51.2 U14.28(TX_D0)
N$53: R50.2 U14.27(TX_D1)
N$54: R49.2 U14.26(TX_D2)
N$55: R48.2 U14.25(TX_D3)
N$57: R46.2 U14.32(RX_CLK)
N$61: R44.2 U14.34(RX_D1)
N$62: R42.2 U14.36(RX_D3)
N$63: Q7.1(G) R65.1
N$64: R58.2 U16.6(OE)
N$65: R55.2 U15.1(DIR2) U15.10(DIR1)
N$66: R54.1 U15.2(OE_N)
N$67: Q6.1(G) R66.1
N$68: Q5.1(G) R67.1
N$71: J4.1 J8.2 U$17.VDC2-
N$83: J3.1 J7.2 U$17.VDC2+
N$114: J2.1 J6.2 U$17.VDC1-
N$115: J1.1 J5.2 U$17.VDC1+
N$143: R151.2 U$11.LED_G-
N$251: R339.2 U54.28(TX_D0)
N$252: R338.2 U54.27(TX_D1)
N$253: R337.2 U54.26(TX_D2)
N$254: R336.2 U54.25(TX_D3)
N$256: R334.2 U54.32(RX_CLK)
N$259: R332.2 U54.34(RX_D1)
N$260: R330.2 U54.36(RX_D3)
N$261: R363.2 U55.29(GTX_CLK)
N$262: R362.2 U55.37(TX_EN_TX_CTRL)
N$263: R361.2 U55.28(TX_D0)
N$264: Q3.1(G) R353.1
N$265: Q2.1(G) R354.1
N$266: Q1.1(G) R355.1
N$267: J9.1 J17.2 U$11.VDC2-
N$268: J11.1 J16.2 U$11.VDC2+
N$269: J12.1 J15.2 U$11.VDC1-
N$270: J13.1 J14.2 U$11.VDC1+
N$271: R360.2 U55.27(TX_D1)
N$272: R359.2 U55.26(TX_D2)
N$273: R358.2 U55.25(TX_D3)
N$275: R348.2 U55.32(RX_CLK)
N$278: R346.2 U55.34(RX_D1)
N$279: R344.2 U55.36(RX_D3)
N$280: Q13.1(G) R367.1
N$281: Q12.1(G) R368.1
N$282: Q4.1(G) R369.1
N$283: J18.1 J25.2 U$12.VDC2-
N$284: J19.1 J24.2 U$12.VDC2+
N$285: J20.1 J23.2 U$12.VDC1-
N$286: J21.1 J22.2 U$12.VDC1+
N$298: R412.2 U$11.LED_YG_G-(LED_GY_G-)
N$354: Q14.1(G) R525.2
N$355: Q15.1(G) R524.1
N$356: D20.P$2 Q15.3(D)
N$357: D19.P$2 Q14.3(D)
N$358: D19.P$1 D20.P$1 R526.1
N$359: Q16.1(G) R527.2
N$360: D21.P$2 Q16.3(D)
N$361: D21.P$1 R528.1
N$362: Q17.1(G) R530.2
N$363: D22.P$2 Q17.3(D)
N$364: D22.P$1 R531.1
N$384: C626.1 R612.2 U$11.SHIELD@1(SHIELD) U$11.SHIELD@2(SHIELD)
N$401: R413.2 U$17.LED_G-
N$402: R414.2 U$17.LED_YG_G-(LED_GY_G-)
N$403: R415.2 U$12.LED_G-
N$404: R416.2 U$12.LED_YG_G-(LED_GY_G-)
N$418: C624.1 R610.2 U$17.SHIELD@1(SHIELD) U$17.SHIELD@2(SHIELD)
N$419: C625.1 R611.2 U$12.SHIELD@1(SHIELD) U$12.SHIELD@2(SHIELD)
PORZ_OUT: R64.1 U17.2(B) U57.2(B) ; also sheet 1,11,13,16,17,18,19
PRG2_ETH1_D0_N [6mil]: U54.2(TD_M_A) U$11.MD1-
PRG2_ETH1_D0_P [6mil]: U54.1(TD_P_A) U$11.MD1+
PRG2_ETH1_D1_N [6mil]: U54.5(TD_M_B) U$11.MD2-
PRG2_ETH1_D1_P [6mil]: U54.4(TD_P_B) U$11.MD2+
PRG2_ETH1_D2_N [6mil]: U54.8(TD_M_C) U$11.MD3-
PRG2_ETH1_D2_P [6mil]: U54.7(TD_P_C) U$11.MD3+
PRG2_ETH1_D3_N [6mil]: U54.11(TD_M_D) U$11.MD4-
PRG2_ETH1_D3_P [6mil]: U54.10(TD_P_D) U$11.MD4+
PRG2_ETH1_GPIO0: R355.2 R433.1 R439.2 U54.39(GPIO_0)
PRG2_ETH1_GPIO1: R445.2 R446.1 U54.40(GPIO_1)
PRG2_ETH1_LED1: Q3.3(D) R151.1
PRG2_ETH1_LED2: Q2.3(D) R356.1 U$11.LED_YG_G+(LED_GY_G+)
PRG2_ETH1_LED3: Q1.3(D) R357.1 R412.1
PRG2_ETH1_LED_1000: R354.2 R435.1 R441.2 U54.45(LED_2)
PRG2_ETH1_LED_ACTIVITY: R353.2 R434.1 R440.2 U54.46(LED_1)
PRG2_ETH2_D0_N [6mil]: U55.2(TD_M_A) U$12.MD1-
PRG2_ETH2_D0_P [6mil]: U55.1(TD_P_A) U$12.MD1+
PRG2_ETH2_D1_N [6mil]: U55.5(TD_M_B) U$12.MD2-
PRG2_ETH2_D1_P [6mil]: U55.4(TD_P_B) U$12.MD2+
PRG2_ETH2_D2_N [6mil]: U55.8(TD_M_C) U$12.MD3-
PRG2_ETH2_D2_P [6mil]: U55.7(TD_P_C) U$12.MD3+
PRG2_ETH2_D3_N [6mil]: U55.11(TD_M_D) U$12.MD4-
PRG2_ETH2_D3_P [6mil]: U55.10(TD_P_D) U$12.MD4+
PRG2_ETH2_GPIO0: R369.2 R447.1 R453.2 U55.39(GPIO_0)
PRG2_ETH2_GPIO1: R459.2 R460.1 U55.40(GPIO_1)
PRG2_ETH2_LED1: Q13.3(D) R415.1
PRG2_ETH2_LED2: Q12.3(D) R370.1 U$12.LED_YG_G+(LED_GY_G+)
PRG2_ETH2_LED3: Q4.3(D) R371.1 R416.1
PRG2_ETH2_LED_1000: R368.2 R449.1 R455.2 U55.45(LED_2)
PRG2_ETH2_LED_ACTIVITY: R367.2 R448.1 R454.2 U55.46(LED_1)
PRG2_ETH_LED0: R527.1 R529.2 ; also sheet 17
PRG2_ETH_LED1: R530.1 R532.2 ; also sheet 17
PRG2_MDC: U54.16(MDC) U55.16(MDC) ; also sheet 1
PRG2_MDIO: U54.17(MDIO) U55.17(MDIO) ; also sheet 1
PRG2_RGMII1_CLKOUT: U54.18(CLK_OUT)
PRG2_RGMII1_ETH1_CLK: U54.15(X_I) ; also sheet 14
PRG2_RGMII1_RBIAS: R328.2 U54.12(RBIAS)
PRG2_RGMII1_RX0: R333.1 ; also sheet 1
PRG2_RGMII1_RX0_R: R333.2 R438.1 R444.2 U54.33(RX_D0)
PRG2_RGMII1_RX1: R332.1 ; also sheet 1
PRG2_RGMII1_RX2: R331.1 ; also sheet 1
PRG2_RGMII1_RX2_R: R331.2 R437.1 R443.2 U54.35(RX_D2)
PRG2_RGMII1_RX3: R330.1 ; also sheet 1
PRG2_RGMII1_RXCLK: R334.1 ; also sheet 1
PRG2_RGMII1_RXCTL: R335.1 ; also sheet 1
PRG2_RGMII1_RXCTL_R: R335.2 R436.1 R442.2 U54.38(RX_DV_RX_CTRL)
PRG2_RGMII1_TX0: R339.1 ; also sheet 1
PRG2_RGMII1_TX1: R338.1 ; also sheet 1
PRG2_RGMII1_TX2: R337.1 ; also sheet 1
PRG2_RGMII1_TX3: R336.1 ; also sheet 1
PRG2_RGMII1_TXCLK: R341.1 ; also sheet 1
PRG2_RGMII1_TXCTL: R340.1 ; also sheet 1
PRG2_RGMII2_ETH2_CLK: U55.15(X_I) ; also sheet 14
PRG2_RGMII2_ETH2_CLKOUT: U55.18(CLK_OUT)
PRG2_RGMII2_RBIAS: R342.2 U55.12(RBIAS)
PRG2_RGMII2_RX0: R347.1 ; also sheet 1
PRG2_RGMII2_RX0_R: R347.2 R452.1 R458.2 U55.33(RX_D0)
PRG2_RGMII2_RX1: R346.1 ; also sheet 1
PRG2_RGMII2_RX2: R345.1 ; also sheet 1
PRG2_RGMII2_RX2_R: R345.2 R451.1 R457.2 U55.35(RX_D2)
PRG2_RGMII2_RX3: R344.1 ; also sheet 1
PRG2_RGMII2_RXCLK: R348.1 ; also sheet 1
PRG2_RGMII2_RXCTL: R352.1 ; also sheet 1
PRG2_RGMII2_RXCTL_R: R352.2 R450.1 R456.2 U55.38(RX_DV_RX_CTRL)
PRG2_RGMII2_TX0: R361.1 ; also sheet 1
PRG2_RGMII2_TX1: R360.1 ; also sheet 1
PRG2_RGMII2_TX2: R359.1 ; also sheet 1
PRG2_RGMII2_TX3: R358.1 ; also sheet 1
PRG2_RGMII2_TXCLK: R363.1 ; also sheet 1
PRG2_RGMII2_TXCTL: R362.1 ; also sheet 1
PRG2_RGMII_INT: R329.1 R343.1 U54.44(INT_PWDN) U55.44(INT_PWDN)
PRG2_RGMII_RESETN: R349.2 U54.43(RESET_N) U55.43(RESET_N) U57.4(Y)
VCC_1V8: C79.1 C80.1 C82.1 C83.1 C84.1 C86.1 C87.1 C91.2 C93.2 C95.2 C96.2 C485.1 C486.1 C487.1 C488.1 C489.1 C490.1 C491.1 C501.2 C502.2 C508.1 C509.1 C510.1 C511.1 C512.1 C513.1 C514.1 C521.2 J1.2 J2.2 J3.2 J4.2 J9.2 J11.2 J12.2 J13.2 J18.2 J19.2 J20.2 J21.2 R41.2 R56.2 R58.1 R60.2 R329.2 R343.2 R419.2 R420.2 R421.2 R422.2 R423.2 R424.2 R432.2 R433.2 R434.2 R435.2 R436.2 R437.2 R438.2 R446.2 R447.2 R448.2 R449.2 R450.2 R451.2 R452.2 R460.2 U14.19(VDDIO_2) U14.30(VDDIO_3) U14.41(VDDIO) U15.7(VCCA) U16.3(VCCA) U17.5(V+) U54.19(VDDIO_2) U54.30(VDDIO_3) U54.41(VDDIO) U55.19(VDDIO_2) U55.30(VDDIO_3) U55.41(VDDIO) U57.5(V+) U$11.MDCT1 U$11.MDCT2 U$11.MDCT3 U$11.MDCT4 U$12.MDCT1 U$12.MDCT2 U$12.MDCT3 U$12.MDCT4 U$17.MDCT1 U$17.MDCT2 U$17.MDCT3 U$17.MDCT4 ; also sheet 1,3,7,8,10,13,14,15,18,19
VCC_3V3_IO: C92.1 C94.2 R57.1 R59.1 R63.2 R64.2 R68.2 R69.2 R351.2 R356.2 R357.2 R370.2 R371.2 R526.2 R528.2 R531.2 U15.6(VCCB) U16.7(VCCB) U$11.LED_G+ U$12.LED_G+ U$17.LED_G+ ; also sheet 1,3,5,7,8,9,10,11,13,14,15,16,17,19
VDD_1V0: C70.1 C71.1 C72.1 C73.1 C74.1 C75.1 C76.1 C77.1 C78.1 C476.1 C477.1 C478.1 C479.1 C480.1 C481.1 C482.1 C483.1 C484.1 C497.1 C498.1 C499.1 C500.1 C503.1 C504.1 C505.1 C506.1 C507.1 U14.6(VDD1P0_2) U14.24(VDD1P0_3) U14.31(VDD1P0_4) U14.42(VDD1P0) U54.6(VDD1P0_2) U54.24(VDD1P0_3) U54.31(VDD1P0_4) U54.42(VDD1P0) U55.6(VDD1P0_2) U55.24(VDD1P0_3) U55.31(VDD1P0_4) U55.42(VDD1P0) ; also sheet 3
VDD_2V5: C81.2 C85.2 C88.2 C89.2 C90.2 C492.2 C493.2 C494.2 C495.2 C496.2 C515.2 C516.2 C517.2 C518.2 C519.2 U14.3(VDDA2P5_2) U14.9(VDDA2P5) U54.3(VDDA2P5_2) U54.9(VDDA2P5) U55.3(VDDA2P5_2) U55.9(VDDA2P5) ; also sheet 3
VSS: C70.2 C71.2 C72.2 C73.2 C74.2 C75.2 C76.2 C77.2 C78.2 C79.2 C80.2 C81.1 C82.2 C83.2 C84.2 C85.1 C86.2 C87.2 C88.1 C89.1 C90.1 C91.1 C92.2 C93.1 C94.1 C95.1 C96.1 C476.2 C477.2 C478.2 C479.2 C480.2 C481.2 C482.2 C483.2 C484.2 C485.2 C486.2 C487.2 C488.2 C489.2 C490.2 C491.2 C492.1 C493.1 C494.1 C495.1 C496.1 C497.2 C498.2 C499.2 C500.2 C501.1 C502.1 C503.2 C504.2 C505.2 C506.2 C507.2 C508.2 C509.2 C510.2 C511.2 C512.2 C513.2 C514.2 C515.1 C516.1 C517.1 C518.1 C519.1 C521.1 C624.2 C625.2 C626.2 J5.1 J6.1 J7.1 J8.1 J14.1 J15.1 J16.1 J17.1 J22.1 J23.1 J24.1 J25.1 Q1.2(S) Q2.2(S) Q3.2(S) Q4.2(S) Q5.2(S) Q6.2(S) Q7.2(S) Q12.2(S) Q13.2(S) Q14.2(S) Q15.2(S) Q16.2(S) Q17.2(S) R27.1 R54.2 R55.1 R61.1 R62.1 R328.1 R342.1 R349.1 R350.1 R425.1 R426.1 R427.1 R428.1 R429.1 R430.1 R431.1 R439.1 R440.1 R441.1 R442.1 R443.1 R444.1 R445.1 R453.1 R454.1 R455.1 R456.1 R457.1 R458.1 R459.1 R529.1 R532.1 R610.1 R611.1 R612.1 U14.49(PAD) U15.3(GND) U16.2(GND) U17.3(V-) U54.49(PAD) U55.49(PAD) U57.3(V-) ; also sheet 1,2,3,4,5,7,8,9,10,11,12,13,14,15,16,17,18,19
Unconnected: U14.14(X_O) U14.20(JTAG_CLK) U14.21(JTAG_TDO) U14.22(JTAG_TMS) U14.23(JTAG_TDI) U14.47(LED_0) U15.4(B2) U15.9(A2) U16.1(B2) U16.4(A2) U54.14(X_O) U54.20(JTAG_CLK) U54.21(JTAG_TDO) U54.22(JTAG_TMS) U54.23(JTAG_TDI) U54.47(LED_0) U55.14(X_O) U55.20(JTAG_CLK) U55.21(JTAG_TDO) U55.22(JTAG_TMS) U55.23(JTAG_TDI) U55.47(LED_0)

## Sheet 7 of 19: JTAG
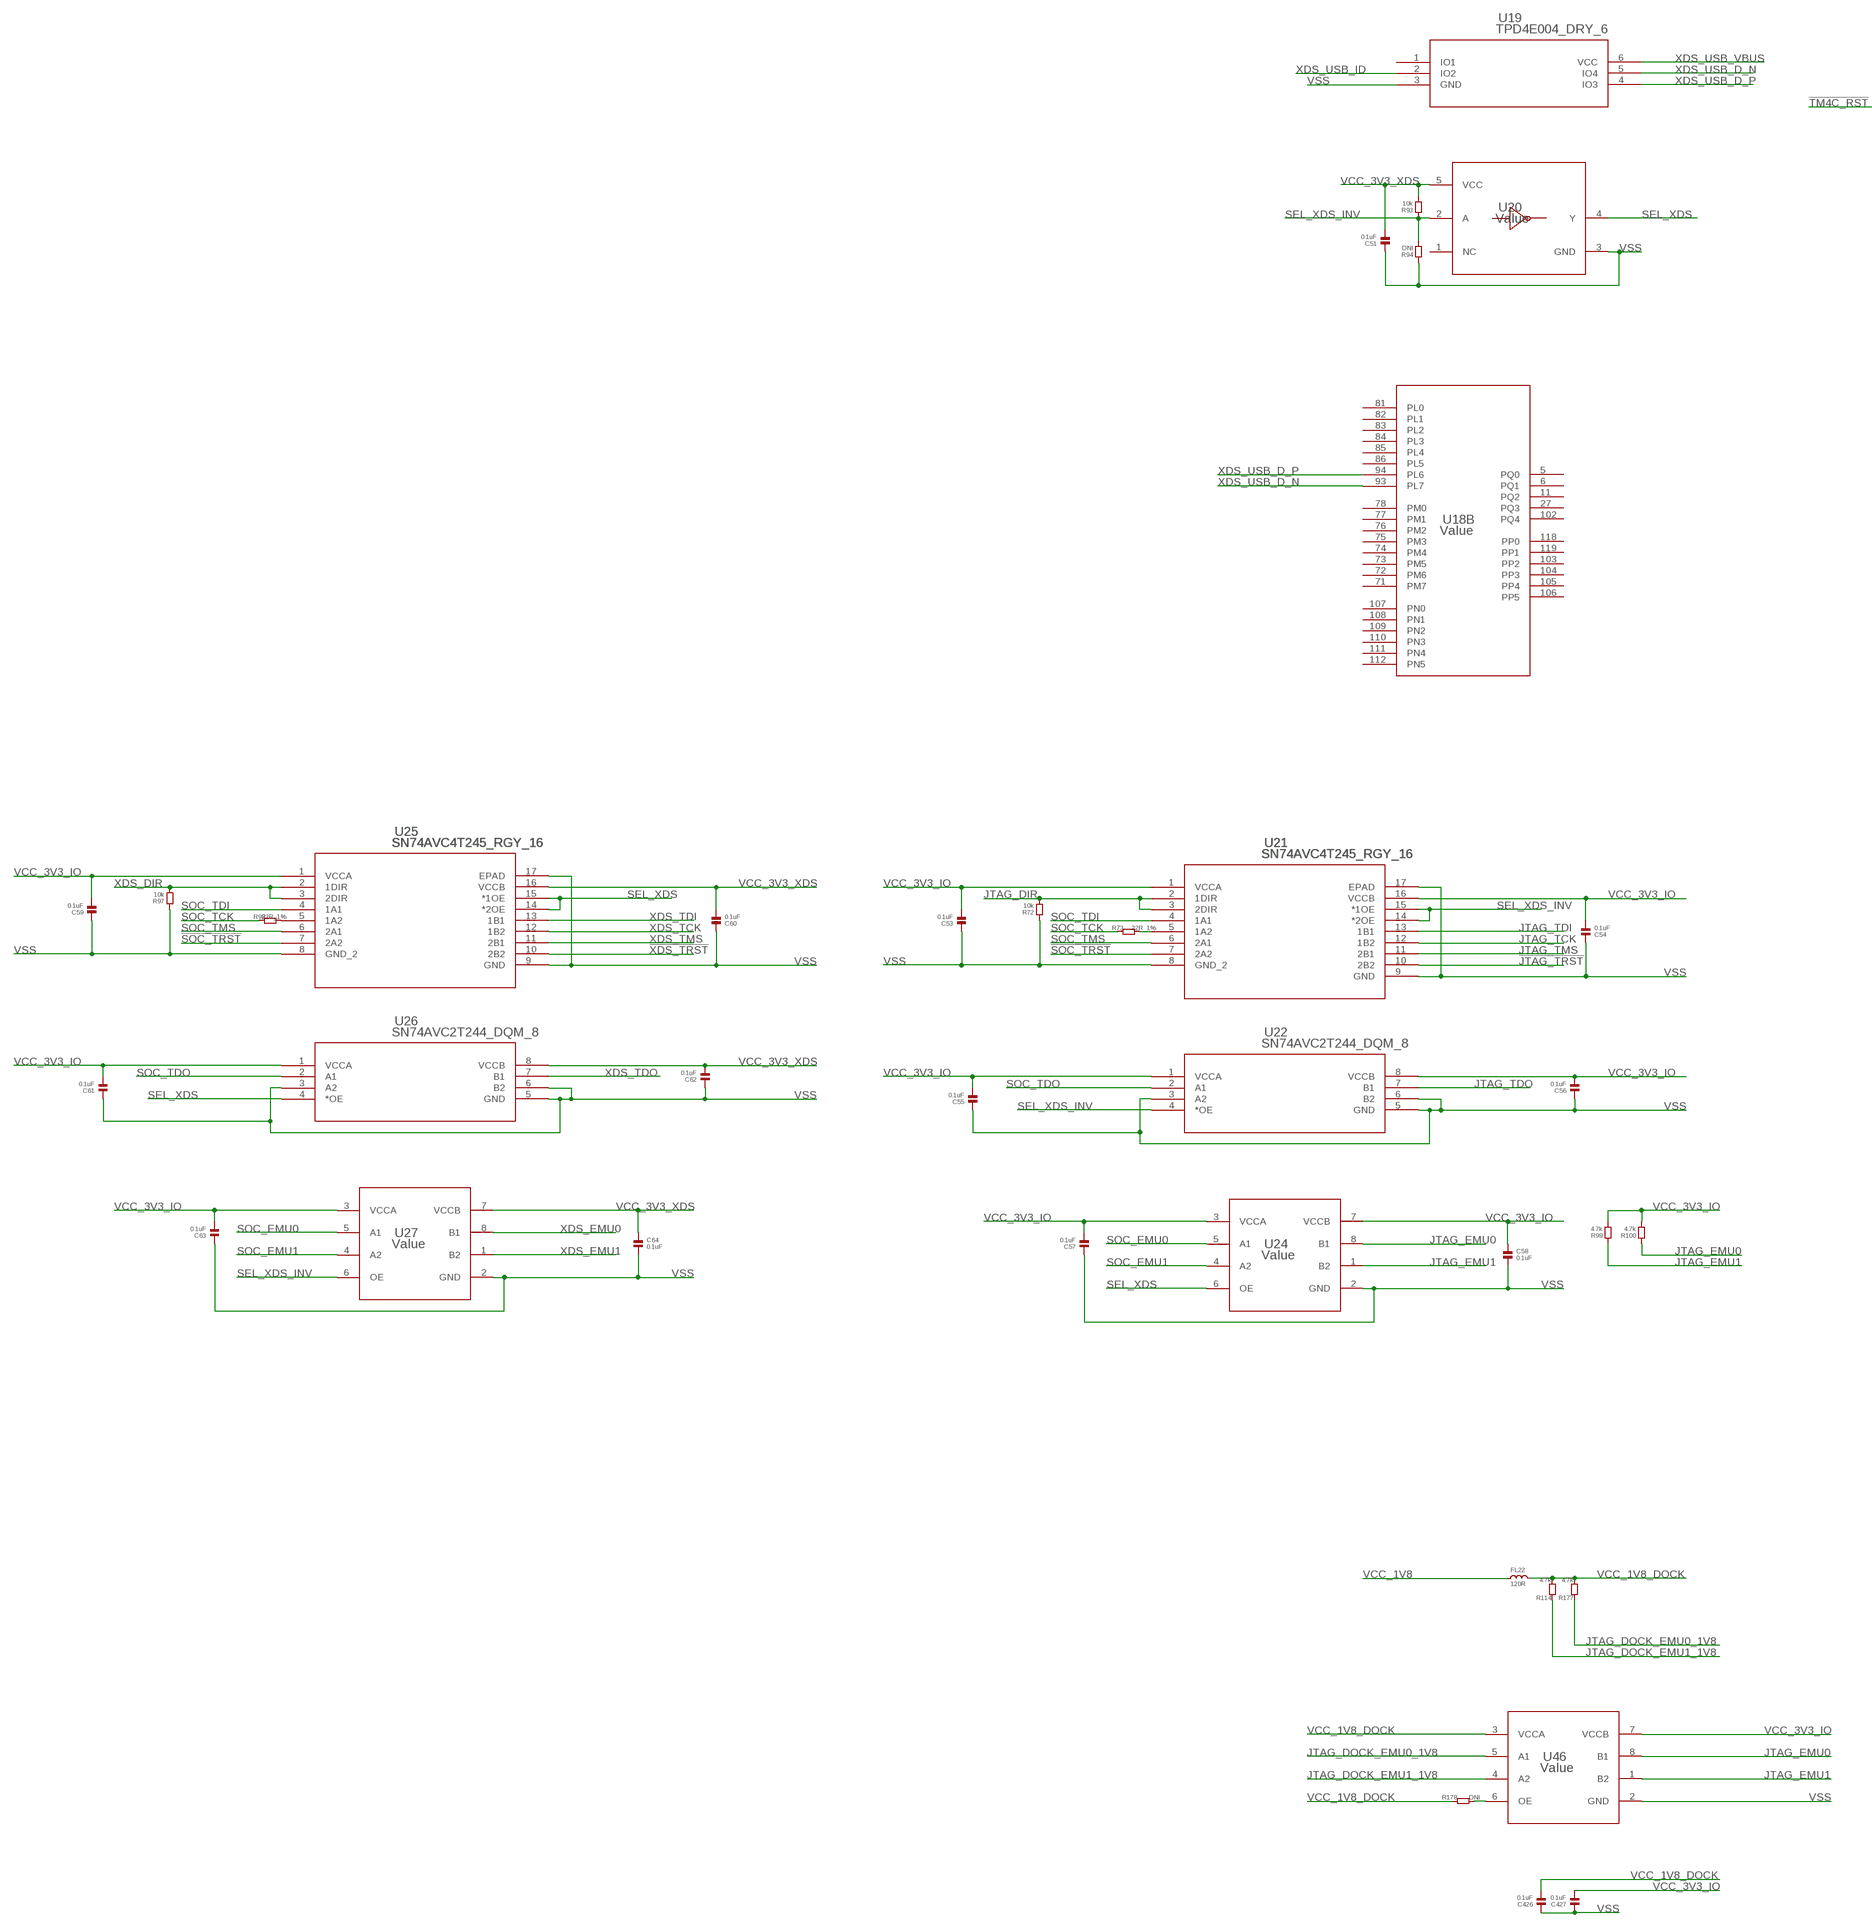
[diagram p14: schematic, sheet 7, part 1 of 2]
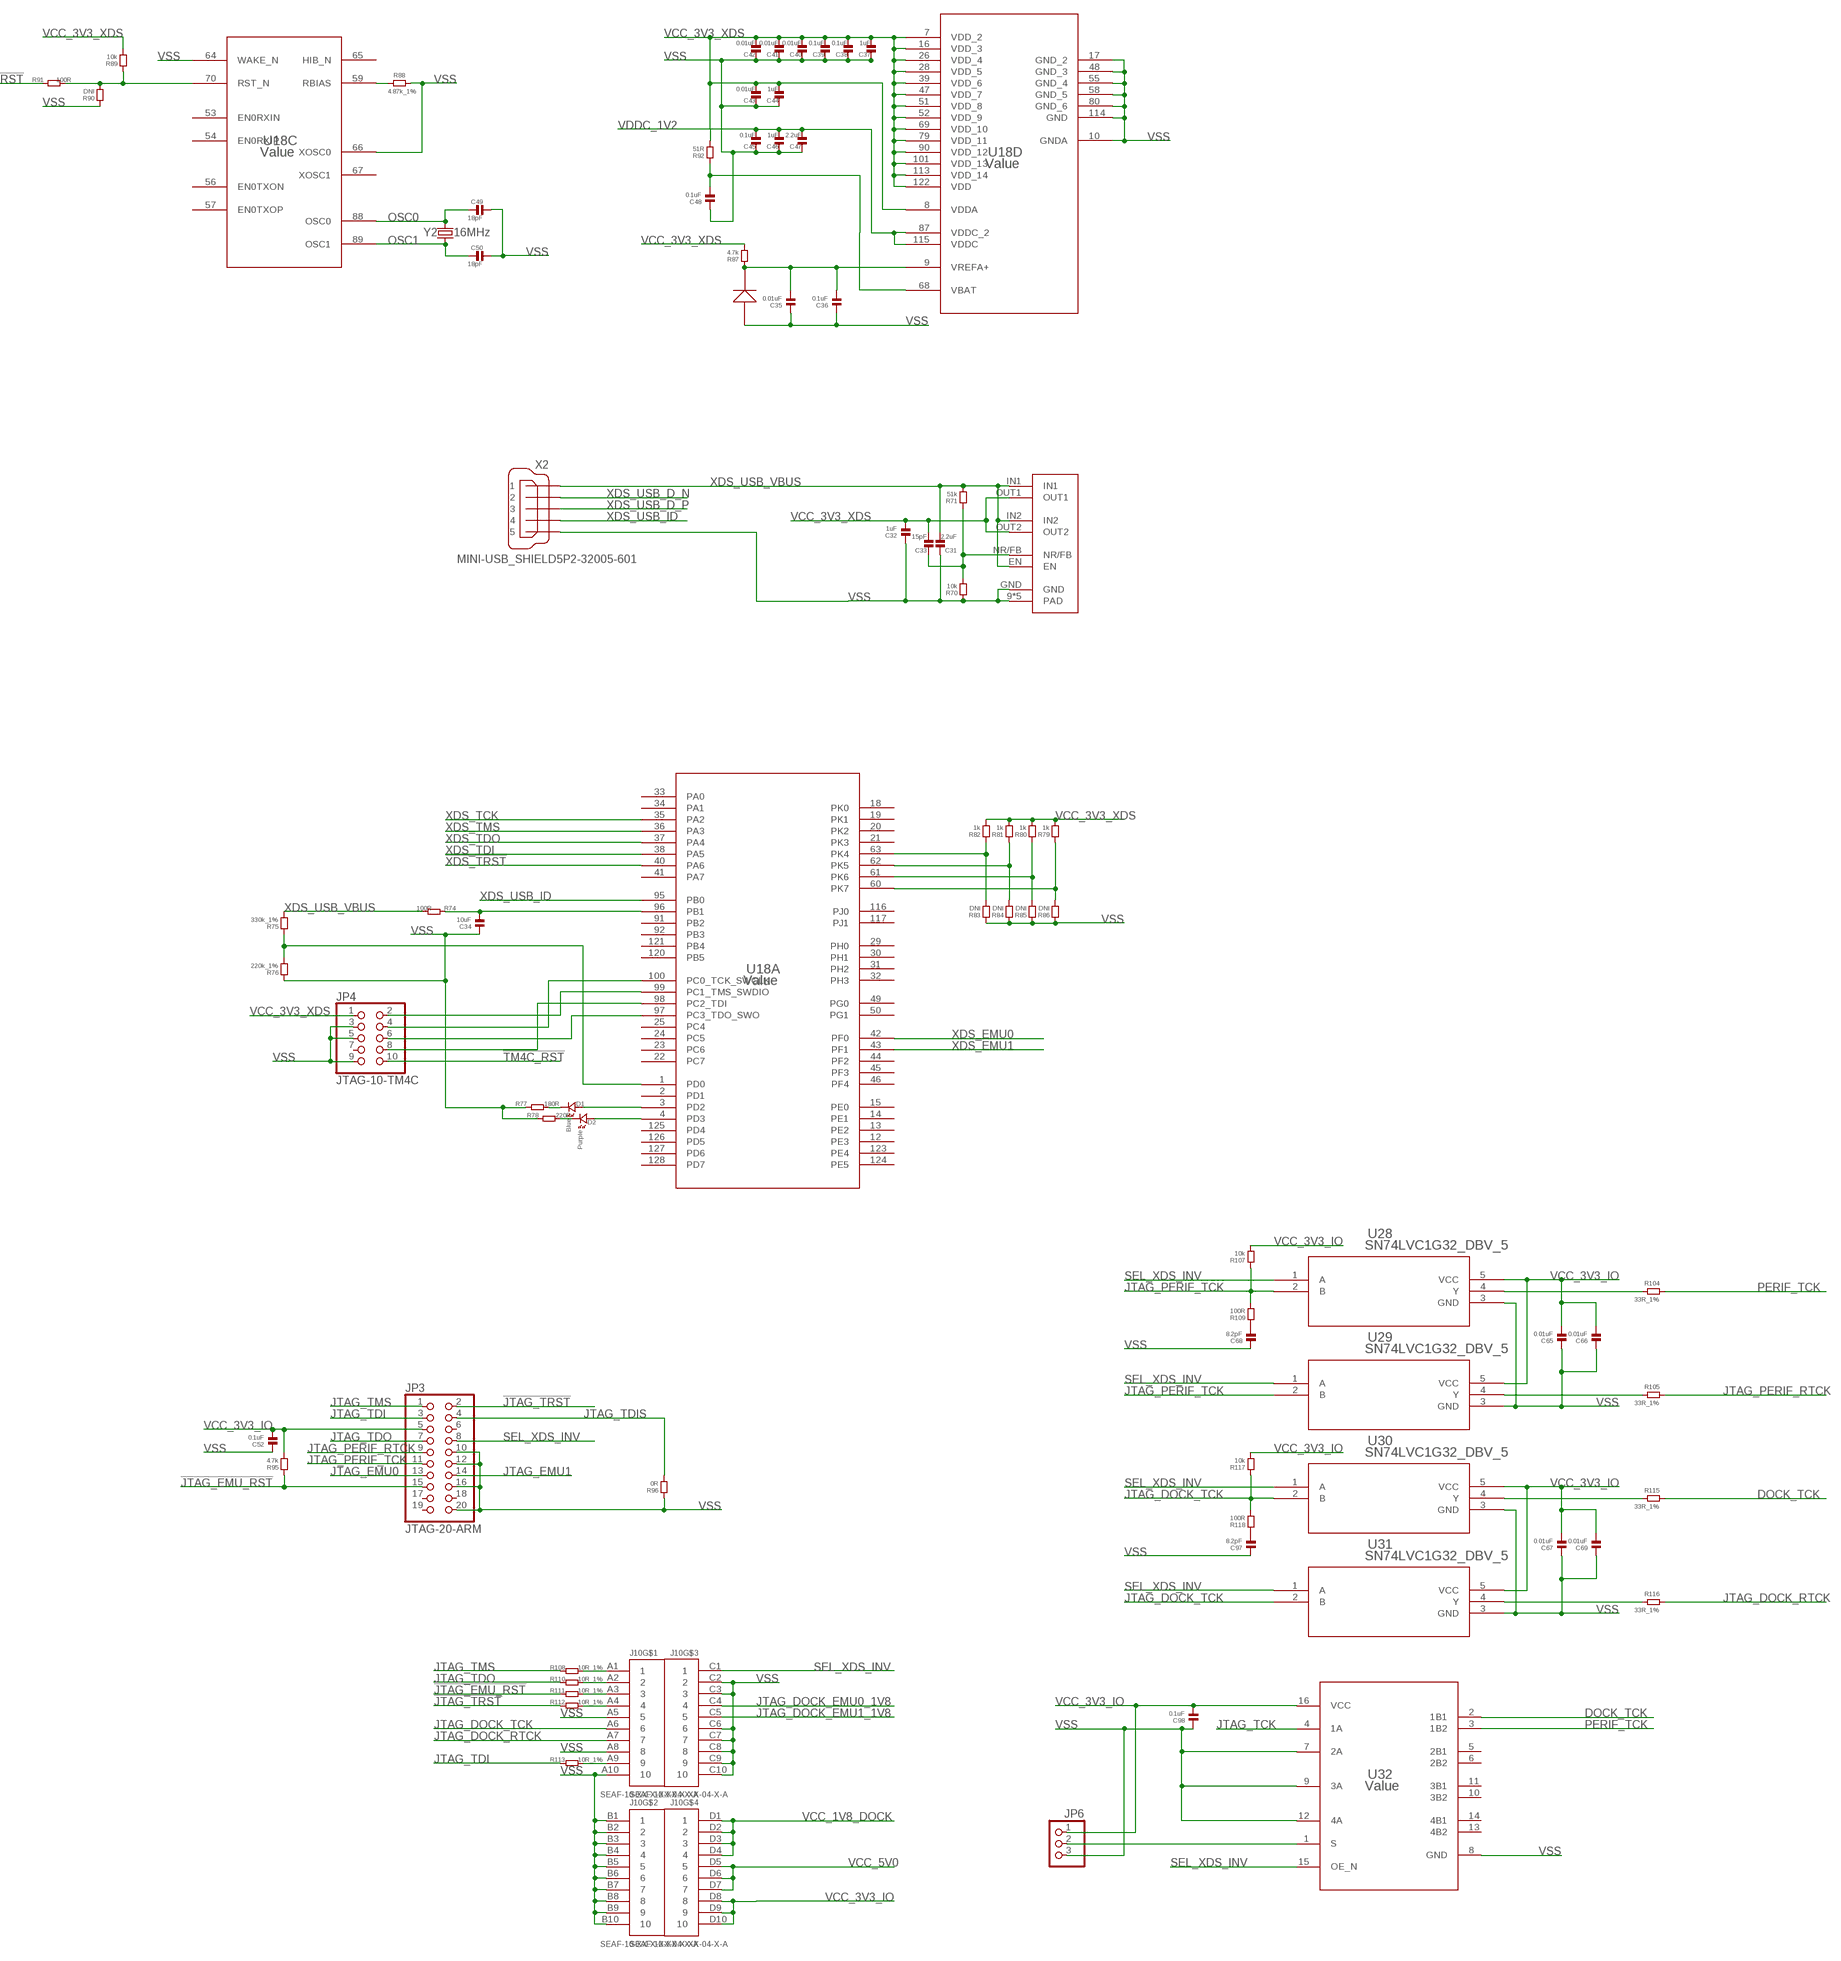
[diagram p15: schematic, sheet 7, part 2 of 2]

### Parts
C31  2.2uF  CAPACITOR.0603  [0603]
C32  1uF  CAPACITOR.0603  [0603]
C33  15pF  CAPACITOR.0603  [0603]
C34  10uF  CAPACITOR.0603  [0603]
C35  0.01uF  CAPACITOR.0402  [0402]
C36  0.1uF  CAPACITOR.0402  [0402]
C37  1uF  CAPACITOR.0402  [0402]
C38  0.1uF  CAPACITOR.0402  [0402]
C39  0.1uF  CAPACITOR.0402  [0402]
C40  0.01uF  CAPACITOR.0402  [0402]
C41  0.01uF  CAPACITOR.0402  [0402]
C42  0.01uF  CAPACITOR.0402  [0402]
C43  0.01uF  CAPACITOR.0402  [0402]
C44  1uF  CAPACITOR.0402  [0402]
C45  0.1uF  CAPACITOR.0402  [0402]
C46  1uF  CAPACITOR.0402  [0402]
C47  2.2uF  CAPACITOR.0603  [0603]
C48  0.1uF  CAPACITOR.0402  [0402]
C49  18pF  CAPACITOR.0603  [0603]
C50  18pF  CAPACITOR.0603  [0603]
C51  0.1uF  CAPACITOR.0402  [0402]
C52  0.1uF  CAPACITOR.0603  [0603]
C53  0.1uF  CAPACITOR.0402  [0402]
C54  0.1uF  CAPACITOR.0402  [0402]
C55  0.1uF  CAPACITOR.0402  [0402]
C56  0.1uF  CAPACITOR.0402  [0402]
C57  0.1uF  CAPACITOR.0402  [0402]
C58  0.1uF  CAPACITOR.0402  [0402]
C59  0.1uF  CAPACITOR.0402  [0402]
C60  0.1uF  CAPACITOR.0402  [0402]
C61  0.1uF  CAPACITOR.0402  [0402]
C62  0.1uF  CAPACITOR.0402  [0402]
C63  0.1uF  CAPACITOR.0402  [0402]
C64  0.1uF  CAPACITOR.0402  [0402]
C65  0.01uF  CAPACITOR.0402  [0402]
C66  0.01uF  CAPACITOR.0402  [0402]
C67  0.01uF  CAPACITOR.0402  [0402]
C68  8.2pF  CAPACITOR.0402  [0402]
C69  0.01uF  CAPACITOR.0402  [0402]
C97  8.2pF  CAPACITOR.0402  [0402]
C98  0.1uF  CAPACITOR.0402  [0402]
C426  0.1uF  CAPACITOR.0603  [0603]
C427  0.1uF  CAPACITOR.0603  [0603]
D1  Blue  LED.0603  [0603.LED]
D2  Purple  LED.0603  [0603.LED]
FL22  120R  RF-INDUCTOR.0603  [0603]
J10  SEAF-10-XX.X-XX-04-X-A  [SEAF-10-XX.X-XX-04-X-A]
JP3  JTAG-20-ARM  PINHD-2X10  [2X10]
JP4  JTAG-10-TM4C  PINHD-2X5  [2X05]
JP6  PINHD-1X3  [1X03]
R70  10k  RESISTOR.0603  [0603]
R71  51k  RESISTOR.0603  [0603]
R72  10k  RESISTOR.0402  [0402]
R73  22R_1%  RESISTOR.0402  [0402]
R74  100R  RESISTOR.0603  [0603]
R75  330k_1%  RESISTOR.0603  [0603]
R76  220k_1%  RESISTOR.0603  [0603]
R77  180R  RESISTOR.0603  [0603]
R78  220R  RESISTOR.0603  [0603]
R79  1k  RESISTOR.0402  [0402]
R80  1k  RESISTOR.0402  [0402]
R81  1k  RESISTOR.0402  [0402]
R82  1k  RESISTOR.0402  [0402]
R83  DNI  RESISTOR.0402  [0402]
R84  DNI  RESISTOR.0402  [0402]
R85  DNI  RESISTOR.0402  [0402]
R86  DNI  RESISTOR.0402  [0402]
R87  4.7k  RESISTOR.0402  [0402]
R88  4.87k_1%  RESISTOR.0402  [0402]
R89  10k  RESISTOR.0603  [0603]
R90  DNI  RESISTOR.0603  [0603]
R91  100R  RESISTOR.0603  [0603]
R92  51R  RESISTOR.0402  [0402]
R93  10k  RESISTOR.0402  [0402]
R94  DNI  RESISTOR.0402  [0402]
R95  4.7k  RESISTOR.0603  [0603]
R96  0R  RESISTOR.0603  [0603]
R97  10k  RESISTOR.0402  [0402]
R98  22R_1%  RESISTOR.0402  [0402]
R99  4.7k  RESISTOR.0402  [0402]
R100  4.7k  RESISTOR.0402  [0402]
R104  33R_1%  RESISTOR.0402  [0402]
R105  33R_1%  RESISTOR.0402  [0402]
R107  10k  RESISTOR.0402  [0402]
R108  10R_1%  RESISTOR.0603  [0603]
R109  100R  RESISTOR.0402  [0402]
R110  10R_1%  RESISTOR.0603  [0603]
R111  10R_1%  RESISTOR.0603  [0603]
R112  10R_1%  RESISTOR.0603  [0603]
R113  10R_1%  RESISTOR.0603  [0603]
R114  4.7k  RESISTOR.0603  [0603]
R115  33R_1%  RESISTOR.0402  [0402]
R116  33R_1%  RESISTOR.0402  [0402]
R117  10k  RESISTOR.0402  [0402]
R118  100R  RESISTOR.0402  [0402]
R177  4.7k  RESISTOR.0603  [0603]
R178  DNI  RESISTOR.0603  [0603]
U18  Value  TM4C1294NCPDTI3R  [PDT0128A_N]
U19  TPD4E004_DRY_6  [DRY6]
U20  Value  SN74LVC1G04DCKR  [DCK0005A_N]
U21  SN74AVC4T245_RGY_16  [RGY16_2P55X2P05]
U22  SN74AVC2T244_DQM_8  [DQM8]
U24  Value  TXS0102DCUR  [DCU0008A_N]
U25  SN74AVC4T245_RGY_16  [RGY16_2P55X2P05]
U26  SN74AVC2T244_DQM_8  [DQM8]
U27  Value  TXS0102DCUR  [DCU0008A_N]
U28  SN74LVC1G32_DBV_5  [DBV5]
U29  SN74LVC1G32_DBV_5  [DBV5]
U30  SN74LVC1G32_DBV_5  [DBV5]
U31  SN74LVC1G32_DBV_5  [DBV5]
U32  Value  SN74CB3Q3257PWR  [PW0016A_N]
U46  Value  TXS0102DCUR  [DCU0008A_N]
U$1  VSON8  [SON65P300X300X100-9N]
U$2  LM4040B25IDCKR13  [SOT65P210X110-5N]
X2  MINI-USB_SHIELD5P2-32005-601  [32005-601]
Y2  16MHz  CRYSTAL-16MHZSMD-5X3.2  [CRYSTAL-SMD-5X3.2-4PAD]

### Nets
!JTAG_EMU_RST: JP3.15 R95.1 R111.1 ; also sheet 5
!JTAG_TRST: JP3.2 R112.1 U21.10(2B2)
!SOC_TRST: U21.7(2A2) U25.7(2A2) ; also sheet 1
!TM4C_RST: JP4.10 R91.1
!XDS_TRST: U18.40(A:PA6) U25.10(2B2)
DOCK_TCK: R115.2 U32.2(1B1)
JTAG_DIR: R72.2 U21.2(1DIR) U21.3(2DIR)
JTAG_DOCK_EMU0_1V8: J10.C4 R177.1 U46.5(A1)
JTAG_DOCK_EMU1_1V8: J10.C5 R114.1 U46.4(A2)
JTAG_DOCK_RTCK: J10.A7 R116.2
JTAG_DOCK_TCK: J10.A6 R117.1 R118.2 U30.2(B) U31.2(B)
JTAG_EMU0: JP3.13 R100.1 U24.8(B1) U46.8(B1)
JTAG_EMU1: JP3.14 R99.1 U24.1(B2) U46.1(B2)
JTAG_PERIF_RTCK: JP3.9 R105.2
JTAG_PERIF_TCK: JP3.11 R107.1 R109.2 U28.2(B) U29.2(B)
JTAG_TCK: U21.12(1B2) U32.4(1A)
JTAG_TDI: JP3.3 R113.1 U21.13(1B1)
JTAG_TDIS: JP3.4 R96.2
JTAG_TDO: JP3.7 R110.1 U22.7(B1)
JTAG_TMS: JP3.1 R108.1 U21.11(2B1)
N$46: R73.1 U21.5(1A2)
N$82: C33.1 R70.2 R71.1 U$1.NR/FB
N$84: C34.2 R74.1 U18.96(A:PB1)
N$85: R75.1 R76.2 U18.1(A:PD0)
N$86: D1.P$1 U18.3(A:PD2)
N$87: D2.P$1 U18.4(A:PD3)
N$88: D1.P$2 R77.1
N$89: D2.P$2 R78.1
N$90: R79.1 R86.2 U18.60(A:PK7)
N$91: R80.1 R85.2 U18.61(A:PK6)
N$92: R81.1 R84.2 U18.62(A:PK5)
N$93: R82.1 R83.2 U18.63(A:PK4)
N$94: C35.2 C36.2 R87.1 U18.9(D:VREFA+) U$2.3(CATHODE)
N$95: R88.1 U18.59(C:RBIAS)
N$96: C48.2 R92.1 U18.68(D:VBAT)
N$97: R98.1 U25.5(1A2)
N$98: R89.1 R90.2 R91.2 U18.70(C:RST_N)
N$99: JP4.4 U18.100(A:PC0_TCK_SWCLK)
N$100: JP4.2 U18.99(A:PC1_TMS_SWDIO)
N$101: JP4.6 U18.97(A:PC3_TDO_SWO)
N$102: JP4.8 U18.98(A:PC2_TDI)
N$106: R104.1 U28.4(Y)
N$107: R105.1 U29.4(Y)
N$108: J10.A1 R108.2
N$109: J10.A2 R110.2
N$110: J10.A3 R111.2
N$111: C68.2 R109.1
N$112: J10.A4 R112.2
N$113: J10.A9 R113.2
N$116: R115.1 U30.4(Y)
N$117: R116.1 U31.4(Y)
N$118: C97.2 R118.1
N$119: JP6.2 U32.1(S)
N$144: R178.2 U46.6(OE)
OSC0: C49.1 U18.88(C:OSC0) Y2.3
OSC1: C50.1 U18.89(C:OSC1) Y2.1
PERIF_TCK: R104.2 U32.3(1B2)
SEL_XDS: U20.4(Y) U24.6(OE) U25.14(*2OE) U25.15(*1OE) U26.4(*OE)
SEL_XDS_INV: J10.C1 JP3.8 R93.1 R94.2 U20.2(A) U21.14(*2OE) U21.15(*1OE) U22.4(*OE) U27.6(OE) U28.1(A) U29.1(A) U30.1(A) U31.1(A) U32.15(OE_N)
SOC_EMU0: U24.5(A1) U27.5(A1) ; also sheet 1
SOC_EMU1: U24.4(A2) U27.4(A2) ; also sheet 1
SOC_TCK: R73.2 R98.2 ; also sheet 1
SOC_TDI: U21.4(1A1) U25.4(1A1) ; also sheet 1
SOC_TDO: U22.2(A1) U26.2(A1) ; also sheet 1
SOC_TMS: U21.6(2A1) U25.6(2A1) ; also sheet 1
VCC_1V8: FL22.1 ; also sheet 1,3,6,8,10,13,14,15,18,19
VCC_1V8_DOCK: C426.2 FL22.2 J10.D1 J10.D2 J10.D3 J10.D4 R114.2 R177.2 R178.1 U46.3(VCCA)
VCC_3V3_IO: C52.2 C53.2 C54.2 C55.2 C56.2 C57.2 C58.1 C59.2 C61.2 C63.2 C65.2 C66.2 C67.2 C69.2 C98.2 C427.2 J10.D8 J10.D9 J10.D10 JP3.5 JP6.1 R95.2 R99.2 R100.2 R107.2 R117.2 U21.1(VCCA) U21.16(VCCB) U22.1(VCCA) U22.8(VCCB) U24.3(VCCA) U24.7(VCCB) U25.1(VCCA) U26.1(VCCA) U27.3(VCCA) U28.5(VCC) U29.5(VCC) U30.5(VCC) U31.5(VCC) U32.16(VCC) U46.7(VCCB) ; also sheet 1,3,5,6,8,9,10,11,13,14,15,16,17,19
VCC_3V3_XDS: C32.2 C33.2 C37.2 C38.2 C39.2 C40.2 C41.2 C42.2 C43.2 C44.2 C51.2 C60.2 C62.2 C64.1 JP4.1 R79.2 R80.2 R81.2 R82.2 R87.2 R89.2 R92.2 R93.2 U18.7(D:VDD_2) U18.8(D:VDDA) U18.16(D:VDD_3) U18.26(D:VDD_4) U18.28(D:VDD_5) U18.39(D:VDD_6) U18.47(D:VDD_7) U18.51(D:VDD_8) U18.52(D:VDD_9) U18.69(D:VDD_10) U18.79(D:VDD_11) U18.90(D:VDD_12) U18.101(D:VDD_13) U18.113(D:VDD_14) U18.122(D:VDD) U20.5(VCC) U25.16(VCCB) U26.8(VCCB) U27.7(VCCB) U$1.OUT1 U$1.OUT2
VCC_5V0: J10.D5 J10.D6 J10.D7 ; also sheet 3,8,9,16,19
VDDC_1V2: C45.2 C46.2 C47.2 U18.87(D:VDDC_2) U18.115(D:VDDC)
VSS: C31.1 C32.1 C34.1 C35.1 C36.1 C37.1 C38.1 C39.1 C40.1 C41.1 C42.1 C43.1 C44.1 C45.1 C46.1 C47.1 C48.1 C49.2 C50.2 C51.1 C52.1 C53.1 C54.1 C55.1 C56.1 C57.1 C58.2 C59.1 C60.1 C61.1 C62.1 C63.1 C64.2 C65.1 C66.1 C67.1 C68.1 C69.1 C97.1 C98.1 C426.1 C427.1 J10.A5 J10.A8 J10.A10 J10.B1 J10.B2 J10.B3 J10.B4 J10.B5 J10.B6 J10.B7 J10.B8 J10.B9 J10.B10 J10.C2 J10.C3 J10.C6 J10.C7 J10.C8 J10.C9 J10.C10 JP3.10 JP3.12 JP3.16 JP3.20 JP4.3 JP4.5 JP4.9 JP6.3 R70.1 R72.1 R76.1 R77.2 R78.2 R83.1 R84.1 R85.1 R86.1 R88.2 R90.1 R94.1 R96.1 R97.1 U18.10(D:GNDA) U18.17(D:GND_2) U18.48(D:GND_3) U18.55(D:GND_4) U18.58(D:GND_5) U18.64(C:WAKE_N) U18.66(C:XOSC0) U18.80(D:GND_6) U18.114(D:GND) U19.3(GND) U20.3(GND) U21.8(GND_2) U21.9(GND) U21.17(EPAD) U22.3(A2) U22.5(GND) U22.6(B2) U24.2(GND) U25.8(GND_2) U25.9(GND) U25.17(EPAD) U26.3(A2) U26.5(GND) U26.6(B2) U27.2(GND) U28.3(GND) U29.3(GND) U30.3(GND) U31.3(GND) U32.7(2A) U32.8(GND) U32.9(3A) U32.12(4A) U46.2(GND) U$1.9(PAD) U$1.9_1(PAD) U$1.9_2(PAD) U$1.9_3(PAD) U$1.9_4(PAD) U$1.GND U$2.1(ANODE) X2.5 ; also sheet 1,2,3,4,5,6,8,9,10,11,12,13,14,15,16,17,18,19
XDS_DIR: R97.2 U25.2(1DIR) U25.3(2DIR)
XDS_EMU0: U18.42(A:PF0) U27.8(B1)
XDS_EMU1: U18.43(A:PF1) U27.1(B2)
XDS_TCK: U18.35(A:PA2) U25.12(1B2)
XDS_TDI: U18.38(A:PA5) U25.13(1B1)
XDS_TDO: U18.37(A:PA4) U26.7(B1)
XDS_TMS: U18.36(A:PA3) U25.11(2B1)
XDS_USB_D_N [6mil]: U18.93(B:PL7) U19.5(IO4) X2.2
XDS_USB_D_P [6mil]: U18.94(B:PL6) U19.4(IO3) X2.3
XDS_USB_ID: U18.95(A:PB0) U19.2(IO2) X2.4
XDS_USB_VBUS: C31.2 R71.2 R74.2 R75.2 U19.6(VCC) U$1.EN U$1.IN1 U$1.IN2 X2.1
Unconnected: JP3.6 JP3.17 JP3.18 JP3.19 JP4.7 U18.2(A:PD1) U18.5(B:PQ0) U18.6(B:PQ1) U18.11(B:PQ2) U18.12(A:PE3) U18.13(A:PE2) U18.14(A:PE1) U18.15(A:PE0) U18.18(A:PK0) U18.19(A:PK1) U18.20(A:PK2) U18.21(A:PK3) U18.22(A:PC7) U18.23(A:PC6) U18.24(A:PC5) U18.25(A:PC4) U18.27(B:PQ3) U18.29(A:PH0) U18.30(A:PH1) U18.31(A:PH2) U18.32(A:PH3) U18.33(A:PA0) U18.34(A:PA1) U18.41(A:PA7) U18.44(A:PF2) U18.45(A:PF3) U18.46(A:PF4) U18.49(A:PG0) U18.50(A:PG1) U18.53(C:EN0RXIN) U18.54(C:EN0RXIP) U18.56(C:EN0TXON) U18.57(C:EN0TXOP) U18.65(C:HIB_N) U18.67(C:XOSC1) U18.71(B:PM7) U18.72(B:PM6) U18.73(B:PM5) U18.74(B:PM4) U18.75(B:PM3) U18.76(B:PM2) U18.77(B:PM1) U18.78(B:PM0) U18.81(B:PL0) U18.82(B:PL1) U18.83(B:PL2) U18.84(B:PL3) U18.85(B:PL4) U18.86(B:PL5) U18.91(A:PB2) U18.92(A:PB3) U18.102(B:PQ4) U18.103(B:PP2) U18.104(B:PP3) U18.105(B:PP4) U18.106(B:PP5) U18.107(B:PN0) U18.108(B:PN1) U18.109(B:PN2) U18.110(B:PN3) U18.111(B:PN4) U18.112(B:PN5) U18.116(A:PJ0) U18.117(A:PJ1) U18.118(B:PP0) U18.119(B:PP1) U18.120(A:PB5) U18.121(A:PB4) U18.123(A:PE4) U18.124(A:PE5) U18.125(A:PD4) U18.126(A:PD5) U18.127(A:PD6) U18.128(A:PD7) U19.1(IO1) U20.1(NC) U32.5(2B1) U32.6(2B2) U32.10(3B2) U32.11(3B1) U32.13(4B2) U32.14(4B1) X2.M1(S1) X2.M2(S2)